# Altium project Hydra A1 UCLO 35131D.PrjPCB (part 12 of 14)
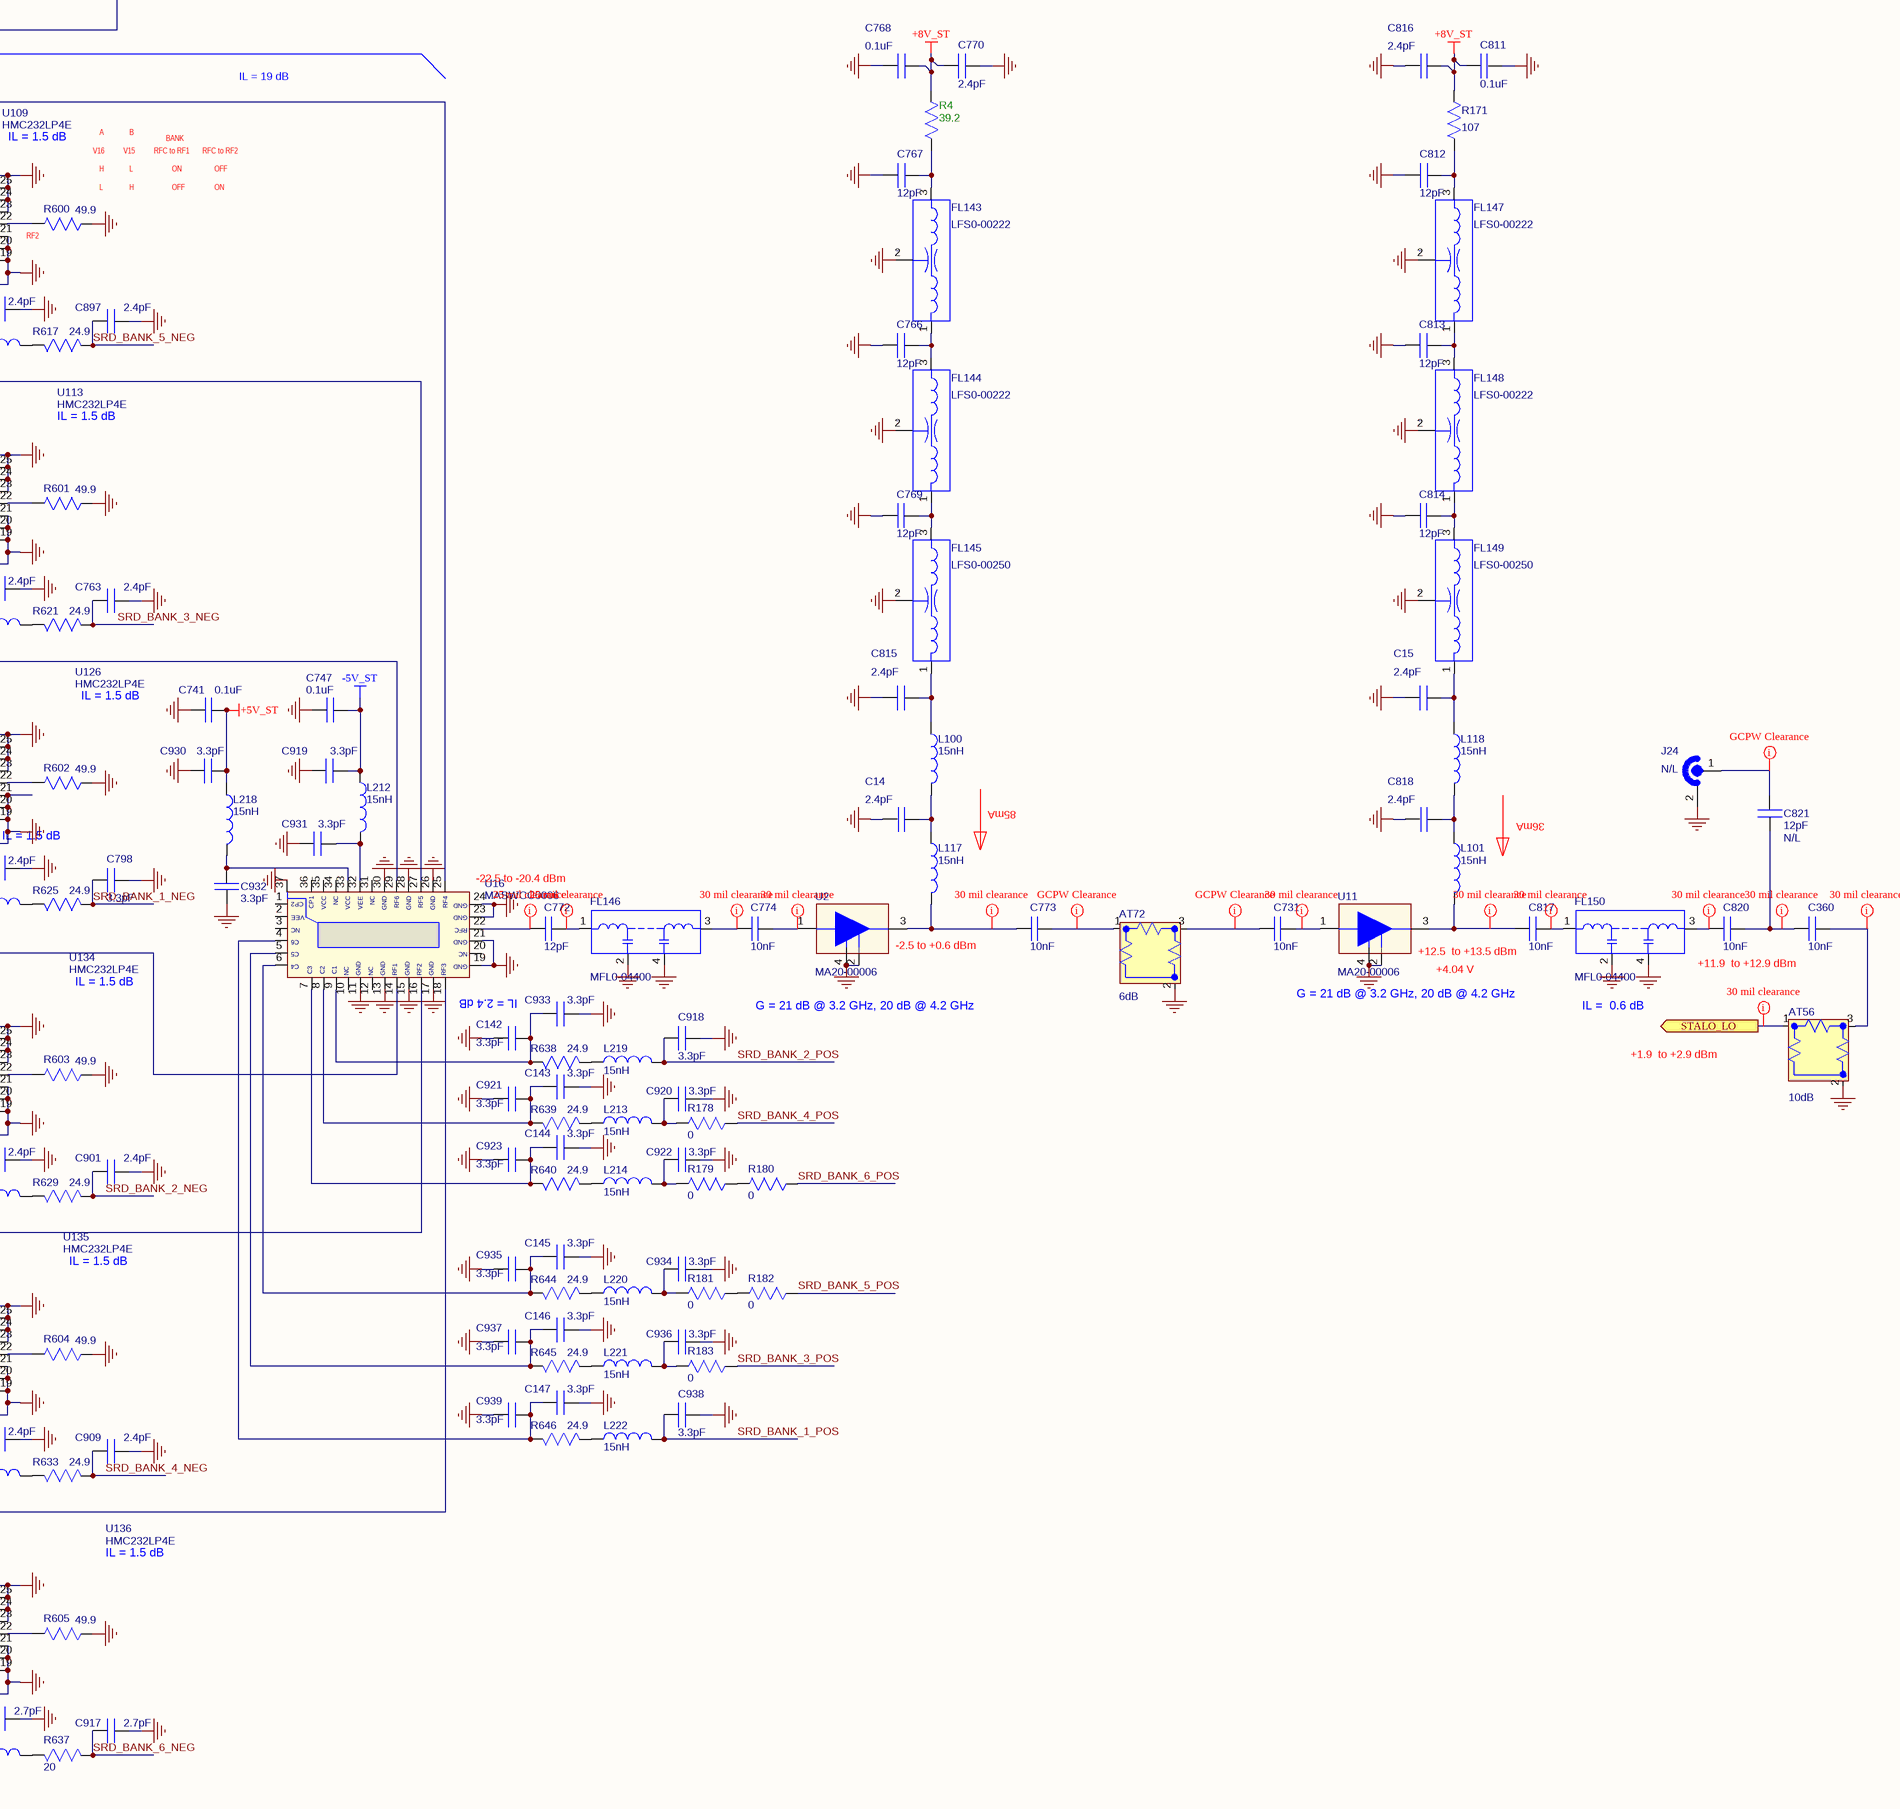
[diagram p76: STALO_1.SchDoc, bottom right]

## Sheet STALO_1.SchDoc: STALO_1 (continued)

### Nets
+5V_ST: C388.1 C741.1 C742.1 C930.2 FT17.1 L138.1 L218.2
+8V_ST: C2.1 C3.1 C768.1 C770.2 C771.2 C811.1 C816.1 FT32.1 R4.1 R171.1 R599.2
-5V_ST: C436.1 C743.1 C747.1 C919.2 FT6.1 L167.1 L212.2
GND: AT1.2(GND) AT3.2(GND) AT6.2(GND) AT10.2(GND) AT12.2(GND) AT14.2(GND) AT43.2(GND) AT44.2(GND) AT45.2(GND) AT46.2(GND) AT47.2(GND) AT48.2(GND) AT49.2(GND) AT50.2(GND) AT51.2(GND) AT52.2(GND) AT56.2(GND) AT72.2(GND) C1.2 C2.2 C3.2 C4.1 C9.1 C11.1 C13.2 C14.2 C15.1 C142.1 C143.2 C144.2 C145.2 C146.2 C147.2 C187.1 C387.2 C388.2 C389.2 C390.2 C391.2 C392.2 C436.2 C437.2 C438.2 C439.2 C717.1 C741.2 C742.2 C743.2 C747.2 C754.2 C755.2 C756.2 C757.2 C758.2 C759.2 C760.2 C761.2 C762.2 C763.2 C764.2 C765.2 C766.1 C767.2 C768.2 C769.1 C770.1 C771.1 C778.2 C779.2 C785.2 C786.2 C791.2 C792.2 C797.2 C798.2 C803.2 C804.2 C809.2 C810.2 C811.2 C812.2 C813.1 C814.1 C815.1 C816.2 C818.2 C894.2 C895.2 C896.2 C897.2 C898.2 C899.2 C900.2 C901.2 C902.2 C903.2 C904.2 C905.2 C906.2 C907.2 C908.2 C909.2 C910.2 C911.2 C912.2 C913.2 C914.2 C915.2 C916.2 C917.2 C918.2 C919.1 C920.2 C921.1 C922.2 C923.1 C924.2 C925.1 C926.2 C927.1 C928.2 C929.1 C930.1 C931.1 C932.1 C933.2 C934.2 C935.1 C936.2 C937.1 C938.2 C939.1 C940.2 C941.2 C942.2 C943.1 C944.1 C945.1 FL1.2(GND) FL2.2(GND) FL3.2(GND) FL4.2(GND) FL4.4(GND) FL4.5(GND) FL4.6(GND) FL7.3 FL7.4 FL7.5 FL7.6 FL7.7 FL7.8 FL7.9 FL7.10 FL7.11 FL7.12 FL8.3 FL8.4 FL8.5 FL8.6 FL8.7 FL8.8 FL8.9 FL8.10 FL8.11 FL8.12 FL16.3 FL16.4 FL16.5 FL16.6 FL16.7 FL16.8 FL16.9 FL16.10 FL16.11 FL16.12 FL17.3 FL17.4 FL17.5 FL17.6 FL17.7 FL17.8 FL17.9 FL17.10 FL17.11 FL17.12 FL24.3 FL24.4 FL24.5 FL24.6 FL24.7 FL24.8 FL24.9 FL24.10 FL24.11 FL24.12 FL25.3 FL25.4 FL25.5 FL25.6 FL25.7 FL25.8 FL25.9 FL25.10 FL25.11 FL25.12 FL30.3 FL30.4 FL30.5 FL30.6 FL30.7 FL30.8 FL30.9 FL30.10 FL30.11 FL30.12 FL31.3 FL31.4 FL31.5 FL31.6 FL31.7 FL31.8 FL31.9 FL31.10 FL31.11 FL31.12 FL35.3 FL35.4 FL35.5 FL35.6 FL35.7 FL35.8 FL35.9 FL35.10 FL35.11 FL35.12 FL36.3 FL36.4 FL36.5 FL36.6 FL36.7 FL36.8 FL36.9 FL36.10 FL36.11 FL36.12 FL40.3 FL40.4 FL40.5 FL40.6 FL40.7 FL40.8 FL40.9 FL40.10 FL40.11 FL40.12 FL41.3 FL41.4 FL41.5 FL41.6 FL41.7 FL41.8 FL41.9 FL41.10 FL41.11 FL41.12 FL93.2(GND) FL93.4(GND) FL143.2(GND) FL144.2(GND) FL145.2(GND) FL146.2(OUT) FL146.4(GND) FL147.2(GND) FL148.2(GND) FL149.2(GND) FL150.2(OUT) FL150.4(GND) J23.2(GND) J24.2(GND) L6.1 L7.1 L46.1 L52.1 L53.1 L58.1 L60.1 L61.1 L62.1 L63.1 L64.1 L70.1 L72.1 L74.1 L75.1 L80.1 L81.1 L82.1 L83.1 L86.1 L87.1 L92.1 L93.1 L94.1 L95.1 L97.1 R1.2 R3.2 R401.2 R596.2 R597.2 R598.2 R600.2 R601.2 R602.2 R603.2 R604.2 R605.2 U1.1(GND) U1.4(GND) U1.5(GND) U2.2(GND) U2.4 U5.1(Vdd) U5.2(Vctl) U5.3(G) U5.5(G) U5.6(NC) U5.7(NC) U5.8(G) U5.10(G) U5.11(NC) U5.12(RF2) U5.13(NC) U5.14(NC) U5.17(NC) U5.18(NC) U5.19(NC) U5.20(NC) U5.21(G) U5.23(G) U5.24(NC) U5.25(G) U6.1(Vdd) U6.2(Vctl) U6.3(G) U6.5(G) U6.6(NC) U6.7(NC) U6.8(G) U6.10(G) U6.11(NC) U6.12(RF2) U6.13(NC) U6.14(NC) U6.17(NC) U6.18(NC) U6.19(NC) U6.20(NC) U6.21(G) U6.23(G) U6.24(NC) U6.25(G) U11.2(GND) U11.4 U12.1(Vdd) U12.2(Vctl) U12.3(G) U12.5(G) U12.6(NC) U12.7(NC) U12.8(G) U12.10(G) U12.11(NC) U12.12(RF2) U12.13(NC) U12.14(NC) U12.17(NC) U12.18(NC) U12.19(NC) U12.20(NC) U12.21(G) U12.23(G) U12.24(NC) U12.25(G) U14.11(GND) U14.13(GND) U14.15(GND) U14.17(GND) U14.19(GND) U14.21(GND) U14.23(GND) U14.24(GND) U14.26(GND) U14.28(GND) U14.30(GND) U14.37(GND) U16.11(GND) U16.13(GND) U16.15(GND) U16.17(GND) U16.19(GND) U16.21(GND) U16.23(GND) U16.24(GND) U16.26(GND) U16.28(GND) U16.30(GND) U16.37(GND) U19.1(Vdd) U19.2(Vctl) U19.3(G) U19.5(G) U19.6(NC) U19.7(NC) U19.8(G) U19.10(G) U19.11(NC) U19.12(RF2) U19.13(NC) U19.14(NC) U19.17(NC) U19.18(NC) U19.19(NC) U19.20(NC) U19.21(G) U19.23(G) U19.24(NC) U19.25(G) U21.1(Vdd) U21.2(Vctl) U21.3(G) U21.5(G) U21.6(NC) U21.7(NC) U21.8(G) U21.10(G) U21.11(NC) U21.12(RF2) U21.13(NC) U21.14(NC) U21.17(NC) U21.18(NC) U21.19(NC) U21.20(NC) U21.21(G) U21.23(G) U21.24(NC) U21.25(G) U24.1(Vdd) U24.2(Vctl) U24.3(G) U24.5(G) U24.6(NC) U24.7(NC) U24.8(G) U24.10(G) U24.11(NC) U24.12(RF2) U24.13(NC) U24.14(NC) U24.17(NC) U24.18(NC) U24.19(NC) U24.20(NC) U24.21(G) U24.23(G) U24.24(NC) U24.25(G) U109.1(Vdd) U109.2(Vctl) U109.3(G) U109.5(G) U109.6(NC) U109.7(NC) U109.8(G) U109.10(G) U109.11(NC) U109.12(RF2) U109.13(NC) U109.14(NC) U109.17(NC) U109.18(NC) U109.19(NC) U109.20(NC) U109.21(G) U109.23(G) U109.24(NC) U109.25(G) U113.1(Vdd) U113.2(Vctl) U113.3(G) U113.5(G) U113.6(NC) U113.7(NC) U113.8(G) U113.10(G) U113.11(NC) U113.12(RF2) U113.13(NC) U113.14(NC) U113.17(NC) U113.18(NC) U113.19(NC) U113.20(NC) U113.21(G) U113.23(G) U113.24(NC) U113.25(G) U126.1(Vdd) U126.2(Vctl) U126.3(G) U126.5(G) U126.6(NC) U126.7(NC) U126.8(G) U126.10(G) U126.11(NC) U126.12(RF2) U126.13(NC) U126.14(NC) U126.17(NC) U126.18(NC) U126.19(NC) U126.20(NC) U126.21(G) U126.23(G) U126.24(NC) U126.25(G) U133.2(GND) U133.4 U134.1(Vdd) U134.2(Vctl) U134.3(G) U134.5(G) U134.6(NC) U134.7(NC) U134.8(G) U134.10(G) U134.11(NC) U134.12(RF2) U134.13(NC) U134.14(NC) U134.17(NC) U134.18(NC) U134.19(NC) U134.20(NC) U134.21(G) U134.23(G) U134.24(NC) U134.25(G) U135.1(Vdd) U135.2(Vctl) U135.3(G) U135.5(G) U135.6(NC) U135.7(NC) U135.8(G) U135.10(G) U135.11(NC) U135.12(RF2) U135.13(NC) U135.14(NC) U135.17(NC) U135.18(NC) U135.19(NC) U135.20(NC) U135.21(G) U135.23(G) U135.24(NC) U135.25(G) U136.1(Vdd) U136.2(Vctl) U136.3(G) U136.5(G) U136.6(NC) U136.7(NC) U136.8(G) U136.10(G) U136.11(NC) U136.12(RF2) U136.13(NC) U136.14(NC) U136.17(NC) U136.18(NC) U136.19(NC) U136.20(NC) U136.21(G) U136.23(G) U136.24(NC) U136.25(G)
~{SRD_BANK_1_NEG}: C764.1 C797.1 R622.1 R624.1 ; port ~{SRD_BANK_1_NEG}
~{SRD_BANK_2_NEG}: C898.1 C900.1 R626.1 R628.1 ; port ~{SRD_BANK_2_NEG}
~{SRD_BANK_3_NEG}: C760.1 C762.1 R618.1 R620.1 ; port ~{SRD_BANK_3_NEG}
~{SRD_BANK_4_NEG}: C906.1 C908.1 R630.1 R632.1 ; port ~{SRD_BANK_4_NEG}
~{SRD_BANK_5_NEG}: C754.1 C896.1 R319.1 R616.1 ; port ~{SRD_BANK_5_NEG}
~{SRD_BANK_6_NEG}: C914.1 C916.1 R634.1 R636.1 ; port ~{SRD_BANK_6_NEG}
SRD_BANK_1_NEG: C792.1 C798.1 R623.1 R625.1 ; port SRD_BANK_1_NEG
SRD_BANK_1_POS: C938.1 C940.1 L222.1 L223.1 ; port SRD_BANK_1_POS
SRD_BANK_2_NEG: C899.1 C901.1 R627.1 R629.1 ; port SRD_BANK_2_NEG
SRD_BANK_2_POS: C918.1 C928.1 L217.1 L219.1 ; port SRD_BANK_2_POS
SRD_BANK_3_NEG: C761.1 C763.1 R619.1 R621.1 ; port SRD_BANK_3_NEG
SRD_BANK_3_POS: C941.1 L224.1 R183.2 ; port SRD_BANK_3_POS
SRD_BANK_4_NEG: C907.1 C909.1 R631.1 R633.1 ; port SRD_BANK_4_NEG
SRD_BANK_4_POS: C926.1 L216.1 R178.2 ; port SRD_BANK_4_POS
SRD_BANK_5_NEG: C895.1 C897.1 R322.1 R617.1 ; port SRD_BANK_5_NEG
SRD_BANK_5_POS: C942.1 L225.1 R182.2 ; port SRD_BANK_5_POS
SRD_BANK_6_NEG: C915.1 C917.1 R635.1 R637.1 ; port SRD_BANK_6_NEG
SRD_BANK_6_POS: C924.1 L215.1 R180.2 ; port SRD_BANK_6_POS
STALO_LO: AT56.1(IN/OUT) ; port STALO_LO
NetAT1_1: AT1.1(IN/OUT) FL7.1 L58.2
NetAT1_3: AT1.3(IN/OUT) FL8.2 L53.2
NetAT3_1: AT3.1(IN/OUT) FL16.1 L61.2
NetAT3_3: AT3.3(IN/OUT) FL17.2 L63.2
NetAT6_1: AT6.1(IN/OUT) FL24.1 L70.2
NetAT6_3: AT6.3(IN/OUT) FL25.2 L74.2
NetAT10_1: AT10.1(IN/OUT) FL30.1 L80.2
NetAT10_3: AT10.3(IN/OUT) FL31.2 L82.2
NetAT12_1: AT12.1(IN/OUT) FL35.1 L86.2
NetAT12_3: AT12.3(IN/OUT) FL36.2 L92.2
NetAT14_1: AT14.1(IN/OUT) FL41.1 L94.2
NetAT14_3: AT14.3(IN/OUT) FL40.2 L97.2
NetAT43_1: AT43.1(IN/OUT) FL4.3(OUT)
NetAT43_3: AT43.3(IN/OUT) U1.3(R)
NetAT44_1: AT44.1(IN/OUT) U1.2(I)
NetAT44_3: AT44.3(IN/OUT) L3.2
NetAT45_1: AT45.1(IN/OUT) FL4.1(IN)
NetAT45_3: AT45.3(IN/OUT) FL93.1(IN)
NetAT46_1: AT46.1(IN/OUT) FL93.3(OUT)
NetAT46_3: AT46.3(IN/OUT) C10.1
NetAT47_1: AT47.1(IN/OUT) FL8.1 L52.2
NetAT47_3: AT47.3(IN/OUT) C777.1
NetAT48_1: AT48.1(IN/OUT) FL17.1 L62.2
NetAT48_3: AT48.3(IN/OUT) C784.1
NetAT49_1: AT49.1(IN/OUT) FL25.1 L72.2
NetAT49_3: AT49.3(IN/OUT) C790.1
NetAT50_1: AT50.1(IN/OUT) FL31.1 L81.2
NetAT50_3: AT50.3(IN/OUT) C796.1
NetAT51_1: AT51.1(IN/OUT) FL36.1 L87.2
NetAT51_3: AT51.3(IN/OUT) C802.1
NetAT52_1: AT52.1(IN/OUT) FL40.1 L95.2
NetAT52_3: AT52.3(IN/OUT) C808.1
NetAT56_3: AT56.3(IN/OUT) C360.2
NetAT58_3: L2.1 ; port 200_MHz_Comb
NetAT72_1: AT72.1(IN/OUT) C773.2
NetAT72_3: AT72.3(IN/OUT) C731.1
NetC1_1: C1.1 FL3.1(IN) L205.1
NetC4_2: C4.2 FL1.1(IN) FL2.3(OUT)
NetC5_1: C5.1 C789.2 L99.2 U133.3
NetC5_2: C5.2 U14.22(RFC)
NetC6_1: C6.1 C8.2 C9.2 L7.2
NetC6_2: C6.2 L4.2
NetC7_1: C7.1 C11.2 L4.1 L6.2
NetC7_2: C7.2 L2.2
NetC8_1: C8.1 L3.1
NetC10_2: C10.2 U133.1
NetC13_1: C13.1 L99.1 L205.2
NetC14_1: C14.1 L100.2 L117.1
NetC15_2: C15.2 FL149.1(IN) L118.1
NetC142_2: C142.2 C933.1 R638.2 U16.9(C1)
NetC143_1: C143.1 C921.2 R639.2 U16.8(C2)
NetC144_1: C144.1 C923.2 R640.2 U16.7(C3)
NetC145_1: C145.1 C935.2 R644.2 U16.6(C4)
NetC146_1: C146.1 C937.2 R645.2 U16.5(C5)
NetC147_1: C147.1 C939.2 R646.2 U16.4(C6)
NetC187_2: C187.2 FL1.3(OUT) R599.1
NetC360_1: C360.1 C820.2 C821.1
NetC387_1: C387.1 L138.2 U14.33(VCC)
NetC389_1: C389.1 L167.2 U14.32(VEE)
NetC390_1: C390.1 C925.2 R641.2 U14.6(C4)
NetC391_1: C391.1 C944.2 R648.2 U14.8(C2)
NetC392_1: C392.1 C945.2 R649.2 U14.7(C3)
NetC437_1: C437.1 C927.2 R642.2 U14.5(C5)
NetC438_1: C438.1 C929.2 R643.2 U14.4(C6)
NetC439_1: C439.1 C943.2 R647.2 U14.9(C1)
NetC717_2: C717.2 FL2.1(IN) FL3.3(OUT)
NetC731_2: C731.2 U11.1
NetC732_1: C732.1 U14.18(RF3)
NetC732_2: C732.2 U5.9(RF1)
NetC733_1: C733.1 U5.4(NC)
NetC733_2: C733.2 FL7.2 L46.2
NetC736_1: C736.1 U6.4(NC)
NetC736_2: C736.2 FL16.2 L60.2
NetC738_1: C738.1 U14.14(RF1)
NetC738_2: C738.2 U12.9(RF1)
NetC739_1: C739.1 U12.4(NC)
NetC739_2: C739.2 FL24.2 L64.2
NetC744_1: C744.1 U14.29(RF6)
NetC744_2: C744.2 U19.9(RF1)
NetC745_1: C745.1 U19.4(NC)
NetC745_2: C745.2 FL30.2 L75.2
NetC748_1: C748.1 U14.27(RF5)
NetC748_2: C748.2 U21.9(RF1)
NetC749_1: C749.1 U21.4(NC)
NetC749_2: C749.2 FL35.2 L83.2
NetC751_1: C751.1 U14.25(RF4)
NetC751_2: C751.2 U24.9(RF1)
NetC752_1: C752.1 U24.4(NC)
NetC752_2: C752.2 FL41.2 L93.2
NetC755_1: C755.1 L96.2 U5.16(A)
NetC756_1: C756.1 L103.2 U6.15(B)
NetC757_1: C757.1 L104.2 U6.16(A)
NetC758_1: C758.1 L105.2 U113.15(B)
NetC759_1: C759.1 L106.2 U113.16(A)
NetC765_1: C765.1 L107.2 U12.15(B)
NetC766_2: C766.2 FL143.1(IN) FL144.3(OUT)
NetC767_1: C767.1 FL143.3(OUT) R4.2
NetC769_2: C769.2 FL144.1(IN) FL145.3(OUT)
NetC772_1: C772.1 U16.22(RFC)
NetC772_2: C772.2 FL146.1(IN)
NetC773_1: C773.1 L117.2 U2.3
NetC774_1: C774.1 FL146.3(GND)
NetC774_2: C774.2 U2.1
NetC775_1: C775.1 U109.4(NC)
NetC775_2: C775.2 U16.25(RF4)
NetC777_2: C777.2 U109.9(RF1)
NetC778_1: C778.1 L98.2 U109.15(B)
NetC779_1: C779.1 L102.2 U109.16(A)
NetC781_1: C781.1 U113.4(NC)
NetC781_2: C781.2 U16.27(RF5)
NetC783_1: C783.1 U14.16(RF2)
NetC783_2: C783.2 U6.9(RF1)
NetC784_2: C784.2 U113.9(RF1)
NetC785_1: C785.1 L108.2 U12.16(A)
NetC786_1: C786.1 L109.2 U126.15(B)
NetC788_1: C788.1 U126.4(NC)
NetC788_2: C788.2 U16.29(RF6)
NetC789_1: C789.1 J23.1(CNTR)
NetC790_2: C790.2 U126.9(RF1)
NetC791_1: C791.1 L110.2 U126.16(A)
NetC794_1: C794.1 U134.4(NC)
NetC794_2: C794.2 U16.14(RF1)
NetC796_2: C796.2 U134.9(RF1)
NetC800_1: C800.1 U135.4(NC)
NetC800_2: C800.2 U16.16(RF2)
NetC802_2: C802.2 U135.9(RF1)
NetC803_1: C803.1 L111.2 U19.15(B)
NetC804_1: C804.1 L112.2 U19.16(A)
NetC806_1: C806.1 U136.4(NC)
NetC806_2: C806.2 U16.18(RF3)
NetC808_2: C808.2 U136.9(RF1)
NetC809_1: C809.1 L113.2 U134.15(B)
NetC810_1: C810.1 L114.2 U134.16(A)
NetC812_1: C812.1 FL147.3(OUT) R171.2
NetC813_2: C813.2 FL147.1(IN) FL148.3(OUT)
NetC814_2: C814.2 FL148.1(IN) FL149.3(OUT)
NetC815_2: C815.2 FL145.1(IN) L100.1
NetC817_1: C817.1 L101.2 U11.3
NetC817_2: C817.2 FL150.1(IN)
NetC818_1: C818.1 L101.1 L118.2
NetC820_1: C820.1 FL150.3(GND)
NetC821_2: C821.2 J24.1(CNTR)
NetC894_1: C894.1 L91.2 U5.15(B)
NetC902_1: C902.1 L115.2 U21.15(B)
NetC903_1: C903.1 L116.2 U21.16(A)
NetC904_1: C904.1 L204.2 U135.15(B)
NetC905_1: C905.1 L207.2 U135.16(A)
NetC910_1: C910.1 L208.2 U24.15(B)
NetC911_1: C911.1 L209.2 U24.16(A)
NetC912_1: C912.1 L210.2 U136.15(B)
NetC913_1: C913.1 L211.2 U136.16(A)
NetC920_1: C920.1 L213.1 R178.1
NetC922_1: C922.1 L214.1 R179.1
NetC931_2: C931.2 L212.1 U16.32(VEE)
NetC932_2: C932.2 L218.1 U16.33(VCC)
NetC934_1: C934.1 L220.1 R181.1
NetC936_1: C936.1 L221.1 R183.1
NetL91_1: L91.1 R319.2
NetL96_1: L96.1 R322.2
NetL98_1: L98.1 R616.2
NetL102_1: L102.1 R617.2
NetL103_1: L103.1 R618.2
NetL104_1: L104.1 R619.2
NetL105_1: L105.1 R620.2
NetL106_1: L106.1 R621.2
NetL107_1: L107.1 R622.2
NetL108_1: L108.1 R623.2
NetL109_1: L109.1 R624.2
NetL110_1: L110.1 R625.2
NetL111_1: L111.1 R626.2
NetL112_1: L112.1 R627.2
NetL113_1: L113.1 R628.2
NetL114_1: L114.1 R629.2
NetL115_1: L115.1 R630.2
NetL116_1: L116.1 R631.2
NetL204_1: L204.1 R632.2
NetL207_1: L207.1 R633.2
NetL208_1: L208.1 R634.2
NetL209_1: L209.1 R635.2
NetL210_1: L210.1 R636.2
NetL211_1: L211.1 R637.2
NetL213_2: L213.2 R639.1
NetL214_2: L214.2 R640.1
NetL215_2: L215.2 R641.1
NetL216_2: L216.2 R642.1
NetL217_2: L217.2 R643.1
NetL219_2: L219.2 R638.1
NetL220_2: L220.2 R644.1
NetL221_2: L221.2 R645.1
NetL222_2: L222.2 R646.1
NetL223_2: L223.2 R647.1
NetL224_2: L224.2 R648.1
NetL225_2: L225.2 R649.1
NetR1_1: R1.1 U5.22(RF2)
NetR3_1: R3.1 U6.22(RF2)
NetR179_2: R179.2 R180.1
NetR181_2: R181.2 R182.1
NetR401_1: R401.1 U12.22(RF2)
NetR596_1: R596.1 U19.22(RF2)
NetR597_1: R597.1 U21.22(RF2)
NetR598_1: R598.1 U24.22(RF2)
NetR600_1: R600.1 U109.22(RF2)
NetR601_1: R601.1 U113.22(RF2)
NetR602_1: R602.1 U126.22(RF2)
NetR603_1: R603.1 U134.22(RF2)
NetR604_1: R604.1 U135.22(RF2)
NetR605_1: R605.1 U136.22(RF2)
NetU1_6: U1.6(L) ; port 2400MHz_Stalo

Not connected (* = marked no-connect by the designer): U14 1(CP2) 2(VEE) 3(NC) 10(NC) 12(NC) 20(NC) 31(NC) 34(NC) 35(VCC) 36(CP1); U16 1(CP2) 2(VEE) 3(NC) 10(NC) 12(NC) 20(NC) 31(NC) 34(NC) 35(VCC) 36(CP1)

### Layout directives
net class GCPW Clearance: NetAT72_1, NetAT72_3, NetC789_1, NetC821_2, NetU1_6
net class 30 mil clearance: NetAT1_1, NetAT1_3, NetAT3_1, NetAT3_3, NetAT6_1, NetAT6_3, NetAT10_1, NetAT10_3, NetAT12_1, NetAT12_3, NetAT14_1, NetAT14_3, NetAT43_1, NetAT43_3, NetAT44_1, NetAT44_3, NetAT45_1, NetAT45_3, NetAT46_1, NetAT46_3, NetAT47_1, NetAT47_3, NetAT48_1, NetAT48_3, NetAT49_1, NetAT49_3, NetAT50_1, NetAT50_3, NetAT51_1, NetAT51_3, NetAT52_1, NetAT52_3, NetAT56_3, NetC6_1, NetC6_2, NetC7_1, NetC7_2, NetC8_1, NetC10_2, NetC360_1, NetC731_2, NetC736_2, NetC739_2, NetC745_2, NetC749_2, NetC752_2, NetC773_1, NetC774_1, NetC774_2, NetC817_1, NetC817_2, NetC820_1, STALO_LO
net class 25 mil clearance: NetC5_1, NetC5_2, NetC732_1, NetC738_1, NetC744_1, NetC748_1, NetC751_1, NetC772_1, NetC772_2, NetC775_2, NetC781_2, NetC783_1, NetC788_2, NetC794_2, NetC800_2, NetC806_2
net class 9.7 mil gap: NetC732_2, NetC733_1, NetC736_1, NetC738_2, NetC739_1, NetC744_2, NetC745_1, NetC748_2, NetC749_1, NetC751_2, NetC752_1, NetC775_1, NetC777_2, NetC781_1, NetC783_2, NetC784_2, NetC788_1, NetC790_2, NetC794_1, NetC796_2, NetC800_1, NetC802_2, NetC806_1, NetC808_2

### Notes on the sheet
- AND DESIGN RIGHTS BELONGING TO GIGA-TRONICS
- THIS DOCUMENT CONTAINS PROPRIETARY INFORMATION
- EXCEPT CALIBRATION, OPERATION, AND MAINTENANCE
- AND MAY NOT BE REPRODUCED FOR ANY REASON
- STALO PAGE 1
- WITHOUT WRITTEN AUTHORIZATION.
- IL= 6.5 - 7 dB
- 85mA
- IL = 6.5 dB
- -23 to -20 dBm
- 2.5 to 5 dBm
- (near U1) CL = 8 dB
- (near C789) G = 21 dB @ 3.2 GHz, 20 dB @ 4.2 GHz
- -3.5 to -1.4 dBm
- 14.2 dBm
- 1.2 GHz  -137dBc
- 3.6 GHz  -124dBc
- IL = 19 dB
- V16
- H
- A
- V15
- L
- B
- RFC to RF1
- BANK
- ON
- RFC to RF2
- (near C732) OFF
- (near U5) RFC
- IL = 3.5 dB
- BANK 5
- RFC
- IL = 1.5 dB
- (near R600) L
- OFF
- (near C732) ON
- RF1
- (near R1) RF2
- (near C777) RF1
- (near R600) RF2
- (near R1) IL = 1.5 dB
- BANK 3
- BANK 1
- (near U126) IL = 1.5 dB
- 36mA
- (near U14) [datasheet] <http://www.macomtech.com/DataSheets/MASWCC0006.pdf>
- (near U16) -22.5 to -20.4 dBm
- (near U2) -2.5 to +0.6 dBm
- (near U11) +12.5  to +13.5 dBm
- (near U11) +4.04 V
- (near FL150) +11.9  to +12.9 dBm
- (near U14) IL = 2.4 dB
- BANK 2
- IL = 2.4 dB
- G = 21 dB @ 3.2 GHz, 20 dB @ 4.2 GHz
- (near FL150) IL =  0.6 dB
- +1.9  to +2.9 dBm
- BANK 4
- BANK 6
- 1.     CAPACITORS VALUES ARE IN pF
- 2.     RESISTOR  VALUES ARE IN OHMS
- NOTES:
- UNLESS OTHERWISE SPECIFIED
- Title
- Sheet Title
- PRINTED DOCUMENT IS CONSIDERED UNCONTROLLED. VERIFY REVISION IN PLM SYSTEM.
- THIS DOCUMENT CONTAINS PROPRIETARY INFORMATION. DESIGN RIGHTS BELONG TO GIGA-TRONICS AND MAY NOT BE REPRODUCED WITHOUT WRITTEN AUTHORIZATION FOR ANY REASON EXCEPT CALIBRATION, OPERATION AND MAINTENANCE.
- Size
- CAGE CODE
- Filename
- D
- Document Number
- 58900
- Date
- Sheet
- Rev
- of
- (in symbol LFS0-00222) ,
- (in symbol LFS0-00250) ,
- (in symbol MRSS-12012) GND

### Library data of the parts
AT1 AT3 AT6 AT10 AT12 AT14 AT46-AT52 = MPFC-A1002: NoLoad: .; Approved: CL; M_PN: IMS1141-02DB; MFGR: IMS RESISTORS; level: 1; line_number: 10; ModifyDate: 3/8/13; G_PN: MPFC-A1002; item_number: MPFC-A1002
AT43 AT44 = MPFC-A1005: NoLoad: .; Approved: CL; M_PN: IMS1141-05DB; MFGR: IMS RESISTORS; level: 1; line_number: 45; ModifyDate: 3/8/13; G_PN: MPFC-A1005; item_number: MPFC-A1005
AT45 = MPFC-A1000: NoLoad: .; Approved: CL; M_PN: IMS1141-00DB; MFGR: IMS RESISTORS; level: 1; line_number: 50; ModifyDate: 4/16/13; G_PN: MPFC-A1000; item_number: MPFC-A1000
AT56 = MPFC-A1010: NoLoad: .; Approved: CL; M_PN: IMS1141-10DB; MFGR: IMS RESISTORS; level: 1; line_number: 55; ModifyDate: 4/23/13; G_PN: MPFC-A1010; item_number: MPFC-A1010
AT72 = MPFC-A1006: NoLoad: .; Approved: CL; M_PN: IMS1141-06DB; MFGR: IMS RESISTORS; level: 1; line_number: 35; ModifyDate: 3/8/13; G_PN: MPFC-A1006; item_number: MPFC-A1006
C1 C13-C15 C187 C754 C755 C758-C764 C770 C771 C778 C779 C786 C791 C792 C803 C804 C809 C810 C815 C816 C818 C894-C901 C904-C909 C914 C915 = CK41-00024: MFGR: ATC; M_PN: 600L2R4AT200; Approved: CL; NoLoad: .; level: 1; line_number: 60; ModifyDate: 02/09/13; G_PN: CK41-00024; item_number: CK41-00024
C2 C768 C811 = CK45-04100: Approved: CL; NoLoad: .; MFGR: ANY; level: 1; line_number: 105; ModifyDate: 02/22/12; G_PN: CK45-04100; M_PN: ANY; item_number: CK45-04100
C3 C4 C717 C766 C767 C769 C812-C814 = CK40-00120: MFGR: ANY; Approved: CL; NoLoad: .; level: 1; line_number: 165; ModifyDate: 10/06/12; M_PN: ANY; G_PN: CK40-00120; item_number: CK40-00120
C5 C10 C732 C733 C736 C738 C739 C744 C745 C748 C749 C751 C752 C772 C775 C777 C781 C783 C784 C788 C790 C794 C796 C800 C802 C806 C808 = CK40-00120: Approved: CL; NoLoad: .; MFGR: ANY; level: 1; line_number: 165; G_PN: CK40-00120; ModifyDate: 10/06/12; M_PN: ANY; item_number: CK40-00120
C6 = CK41-00016: Approved: CL; NoLoad: .; M_PN: 600L1R6AT200; MFGR: ATC; level: 1; line_number: 240; G_PN: CK41-00016; ModifyDate: 4/15/13; item_number: CK41-00016
C7 C8 = CK41-00030: Approved: CL; NoLoad: .; M_PN: 600L3R0AT200; MFGR: ATC; level: 1; line_number: 265; G_PN: CK41-00030; ModifyDate: 02/22/12; item_number: CK41-00030
C9 C11 = CK41-00027: Approved: CL; NoLoad: .; M_PN: 600L2R7AT200; MFGR: ATC; level: 1; line_number: 305; G_PN: CK41-00027; ModifyDate: 4/15/13; item_number: CK41-00027
C142-C147 C387-C392 C436-C439 C756 C757 C765 C785 C797 C798 C902 C903 C910 C911 C918-C945 = CK35-00033: MFGR: VENKEL; M_PN: C0201C0G500-3R3BNP; Approved: CL; NoLoad: .; level: 1; line_number: 155; ModifyDate: 6/24/13; G_PN: CK35-00033; item_number: CK35-00033
C360 C731 C773 C774 C817 C820 = TCC3-03100: Approved: CL; NoLoad: .; MFGR: ATC; M_PN: ATC520L103KT16T; level: 1; line_number: 90; G_PN: TCC3-03100; ModifyDate: 4/26/13; item_number: TCC3-03100
C741-C743 C747 = CK40-04100: Approved: CL; MFGR: VENKEL; M_PN: C0402X7R160-104KNP; NoLoad: .; level: 1; line_number: 95; ModifyDate: 3/29/13; G_PN: CK40-04100; item_number: CK40-04100
C789 C821 = CK40-00120: Approved: CL; MFGR: ANY; level: 1; line_number: 165; G_PN: CK40-00120; ModifyDate: 10/06/12; M_PN: ANY; item_number: CK40-00120
C912 C913 C916 C917 = CK35-00027: MFGR: VENKEL; M_PN: C0201C0G500-2R7BNP; Approved: CL; NoLoad: .; level: 1; line_number: 310; ModifyDate: 6/13/13; G_PN: CK35-00027; item_number: CK35-00027
FL1 FL2 FL143 FL144 FL147 FL148 = LFS0-00222: Approved: CL; NoLoad: .; M_PN: NFE31PT222Z1E9BL; MFGR: MURATA; level: 1; line_number: 335; G_PN: LFS0-00222; ModifyDate: 02/22/12; Value: 2200pF; item_number: LFS0-00222
FL3 FL145 FL149 = LFS0-00250: Approved: NM; NoLoad: .; M_PN: NFL18ST207X1C3; MFGR: MURATA; level: 1; line_number: 415; ModifyDate: 02/22/12; Value: 25pF; G_PN: LFS0-00250; item_number: LFS0-00250
FL4 = MFH0-03100: MFGR: MINI-CIRCUITS; Approved: CL; Value: HFCN-3100D+; NoLoad: .; level: 1; line_number: 445; G_PN: MFH0-03100; ModifyDate: 4/2/13; item_number: MFH0-03100
FL7 FL8 = MFB1-04000: Approved: CL; MFGR: LARK ENGINEERING; NoLoad: .; Value: 4SD4000-U70-6CC; level: 1; line_number: 465; G_PN: MFB1-04000; ModifyDate: 4/8/13; M_PN: 4SD4000-U70-6CC; item_number: MFB1-04000
FL16 FL17 = MFB1-03600: FILTER;CER;BANDPASS;3600MHZ;70MHZ BW;6-SEC;SMT; Approved: CL; MFGR: LARK ENGINEERING; NoLoad: .; level: 1; line_number: 350; ModifyDate: 4/8/13; Value: 4SD3600-U70-6CC; M_PN: 4SD3600-U70-6CC; G_PN: MFB1-03600; item_number: MFB1-03600
FL24 FL25 = MFB1-03200: Approved: CL; MFGR: LARK ENGINEERING; NoLoad: .; Value: 4SD3200-U70-6CC; level: 1; line_number: 375; ModifyDate: 4/8/13; M_PN: 4SD3200-U70-6CC; G_PN: MFB1-03200; item_number: MFB1-03200
FL30 FL31 = MFB1-03400: Approved: CL; MFGR: LARK ENGINEERING; NoLoad: .; Value: 4SD3400-U70-6CC; level: 1; line_number: 420; ModifyDate: 4/8/13; M_PN: 4SD3400-U70-6CC; G_PN: MFB1-03400; item_number: MFB1-03400
FL35 FL36 = MFB1-03800: Approved: CL; MFGR: LARK ENGINEERING; NoLoad: .; Value: 4SD3800-U70-6CC; level: 1; line_number: 435; ModifyDate: 4/8/13; M_PN: 4SD3800-U70-6CC; G_PN: MFB1-03800; item_number: MFB1-03800
FL40 FL41 = MFB1-04200: Approved: CL; MFGR: LARK ENGINEERING; NoLoad: .; Value: 4SD4200-U70-6CC; level: 1; line_number: 450; ModifyDate: 4/8/13; M_PN: 4SD4200-U70-6CC; G_PN: MFB1-04200; item_number: MFB1-04200
FL93 = MFL1-03900: NoLoad: .; Value: LFCN-3800D+; MFGR: MINI-CIRCUITS; Approved: CL; level: 1; line_number: 470; ModifyDate: 3/21/13; G_PN: MFL1-03900; item_number: MFL1-03900
FL146 FL150 = MFL0-04400: NoLoad: .; MFGR: Mini-Circuits; Approved: NM; level: 1; line_number: 340; Value: LFCN-4400; ModifyDate: 11/17/12; M_PN: LFCN-4400; G_PN: MFL0-04400; item_number: MFL0-04400
FT6 FT17 FT32 = FromToNode: level: 1; Approved: *; G_PN: *; MFGR: *; Value: *
J23 J24 = JRSM-40101: Value: 3287-6101; MFGR: SV MICROWAVE; Approved: CL; level: 1; M_PN: 3287-6101; ModifyDate: 4/10/13; G_PN: JRSM-40101; item_number: JRSM-40101
L2 L3 = LSA5-02430: MFGR: COILCRAFT; NoLoad: .; Approved: CL; M_PN: 0603HP-4N3XGLU; level: 1; line_number: 535; ModifyDate: 3/4/13; G_PN: LSA5-02430; item_number: LSA5-02430
L4 = LSA5-02870: MFGR: COILCRAFT; NoLoad: .; Approved: CL; M_PN: 0603HP-8N7XGLU; level: 1; line_number: 575; ModifyDate: 02/22/13; G_PN: LSA5-02870; item_number: LSA5-02870
L6 L7 L75 L80-L82 = LSA5-02390: MFGR: COILCRAFT; NoLoad: .; Approved: CL; M_PN: 0603HP-3N9XGLU; level: 1; line_number: 610; ModifyDate: 3/4/13; G_PN: LSA5-02390; item_number: LSA5-02390
L46 L52 L53 L58 L60-L63 L83 L86 L87 L92 = LSA5-02330: MFGR: COILCRAFT; NoLoad: .; Approved: CL; M_PN: 0603HP-3N3XGLU; level: 1; line_number: 590; ModifyDate: 02/22/12; G_PN: LSA5-02330; item_number: LSA5-02330
L64 L70 L72 L74 = LSA5-02470: MFGR: COILCRAFT; NoLoad: .; Approved: CL; M_PN: 0603HP-4N7XGLU; level: 1; line_number: 615; ModifyDate: 4/5/13; G_PN: LSA5-02470; item_number: LSA5-02470
L91 L96 L98-L118 L138 L167 L204 L205 L207-L225 = LSA6-03150: MFGR: COILCRAFT; NoLoad: .; Approved: CL; M_PN: 0402HP-15NXGLU; level: 1; line_number: 515; ModifyDate: 3/8/13; G_PN: LSA6-03150; item_number: LSA6-03150
L93-L95 L97 = LSA5-02180: MFGR: COILCRAFT; NoLoad: .; Approved: CL; M_PN: 0603HP-1N8XJLU; level: 1; line_number: 625; ModifyDate: 5/16/13; G_PN: LSA5-02180; item_number: LSA5-02180
R1 R3 R401 R596-R598 R600-R605 = RK35-00499: Approved: CL; NoLoad: .; MFGR: ANY; level: 1; line_number: 650; ModifyDate: 02/22/12; G_PN: RK35-00499; M_PN: ANY; item_number: RK35-00499
R4 R599 = RK65-00392: NoLoad: .; MFGR: VISHAY/DALE; Approved: CL; M_PN: CRCW201039R2FKEF; level: 1; line_number: 892; ModifyDate: 10/14/14; G_PN: RK65-00392; item_number: RK65-00392
R171 = RK65-01107: NoLoad: .; MFGR: VISHAY/DALE; Approved: CL; M_PN: CRCW2010107RFKEF; level: 1; line_number: 715; ModifyDate: 4/23/13; G_PN: RK65-01107; item_number: RK65-01107
R178-R183 = RK40-00000: NoLoad: .; MFGR: ANY; Approved: CL; level: 1; line_number: 710; ModifyDate: 3/27/13; M_PN: ANY; G_PN: RK40-00000; item_number: RK40-00000
R319 R322 R616-R635 R638-R649 = RK35-00249: NoLoad: .; Approved: CL; MFGR: ANY; level: 1; line_number: 655; G_PN: RK35-00249; ModifyDate: 02/22/12; M_PN: ANY; item_number: RK35-00249
R636 R637 = RK30-00200: NoLoad: .; Approved: CL; MFGR: Vishay-Dale; M_PN: CRCW020120R0FNED; level: 1; line_number: 782; G_PN: RK30-00200; ModifyDate: 7/24/13; item_number: RK30-00200
U1 = MMTD-00004: M_PN: ADE-42MH+; Approved: NM; MFGR: MINI-CIRCUITS; NoLoad: .; Value: ADE-42MH+; level: 1; line_number: 1095; G_PN: MMTD-00004; ModifyDate: 4/9/13; item_number: MMTD-00004
U2 U11 U133 = MA20-00006: M_PN: SKY65017-70LF; Approved: CL; MFGR: SKYWORKS; NoLoad: .; Value: SKY65017-70LF; level: 1; line_number: 1160; G_PN: MA20-00006; ModifyDate: 6/26/14; item_number: MA20-00006
U5 U6 U12 U19 U21 U24 U109 U113 U126 U134-U136 = MRSS-12012: MFGR: HITTITE; Approved: CL; Value: HMC232LP4E; NoLoad: .; level: 1; line_number: 1210; ModifyDate: 4/8/13; G_PN: MRSS-12012; item_number: MRSS-12012
U14 U16 = MRSS-16004: MFGR: HITTITE; Approved: CL; Value: MASWCC0006; NoLoad: .; level: 1; line_number: 1135; ModifyDate: 4/8/13; G_PN: MRSS-16004; item_number: MRSS-16004

## Sheet STALO_3.SchDoc: STALO_3
size D; Date: 09-24-10; DrawnBy: C. Lewis; Engineer: C. Lewis; Address1: 4650 NORRIS CANYON RD.; Address2: SAN RAMON, CA 94583; DocumentNumber: 35133; Revision: D; SheetNumber: 20; SheetTotal: 20; PageSetup: Record=PageOptions|CenterHorizontal=True|CenterVertical=True|PrintScale=0.34|XCorrection=1.00|YCorrection=1.00|PrintKind=1|BorderSize=5000000|LeftOffset=0|BottomOffset=0|Orientation=2|PaperLength=1000|PaperWidth=1000|Scale=100|PaperSource=15|PrintQuality=600|MediaType=1|DitherType=10|PaperKind=11x17|PrintScaleMode=1; DocumentName: Sheet1.SCHDOC; ModifiedDate: 10-27-11
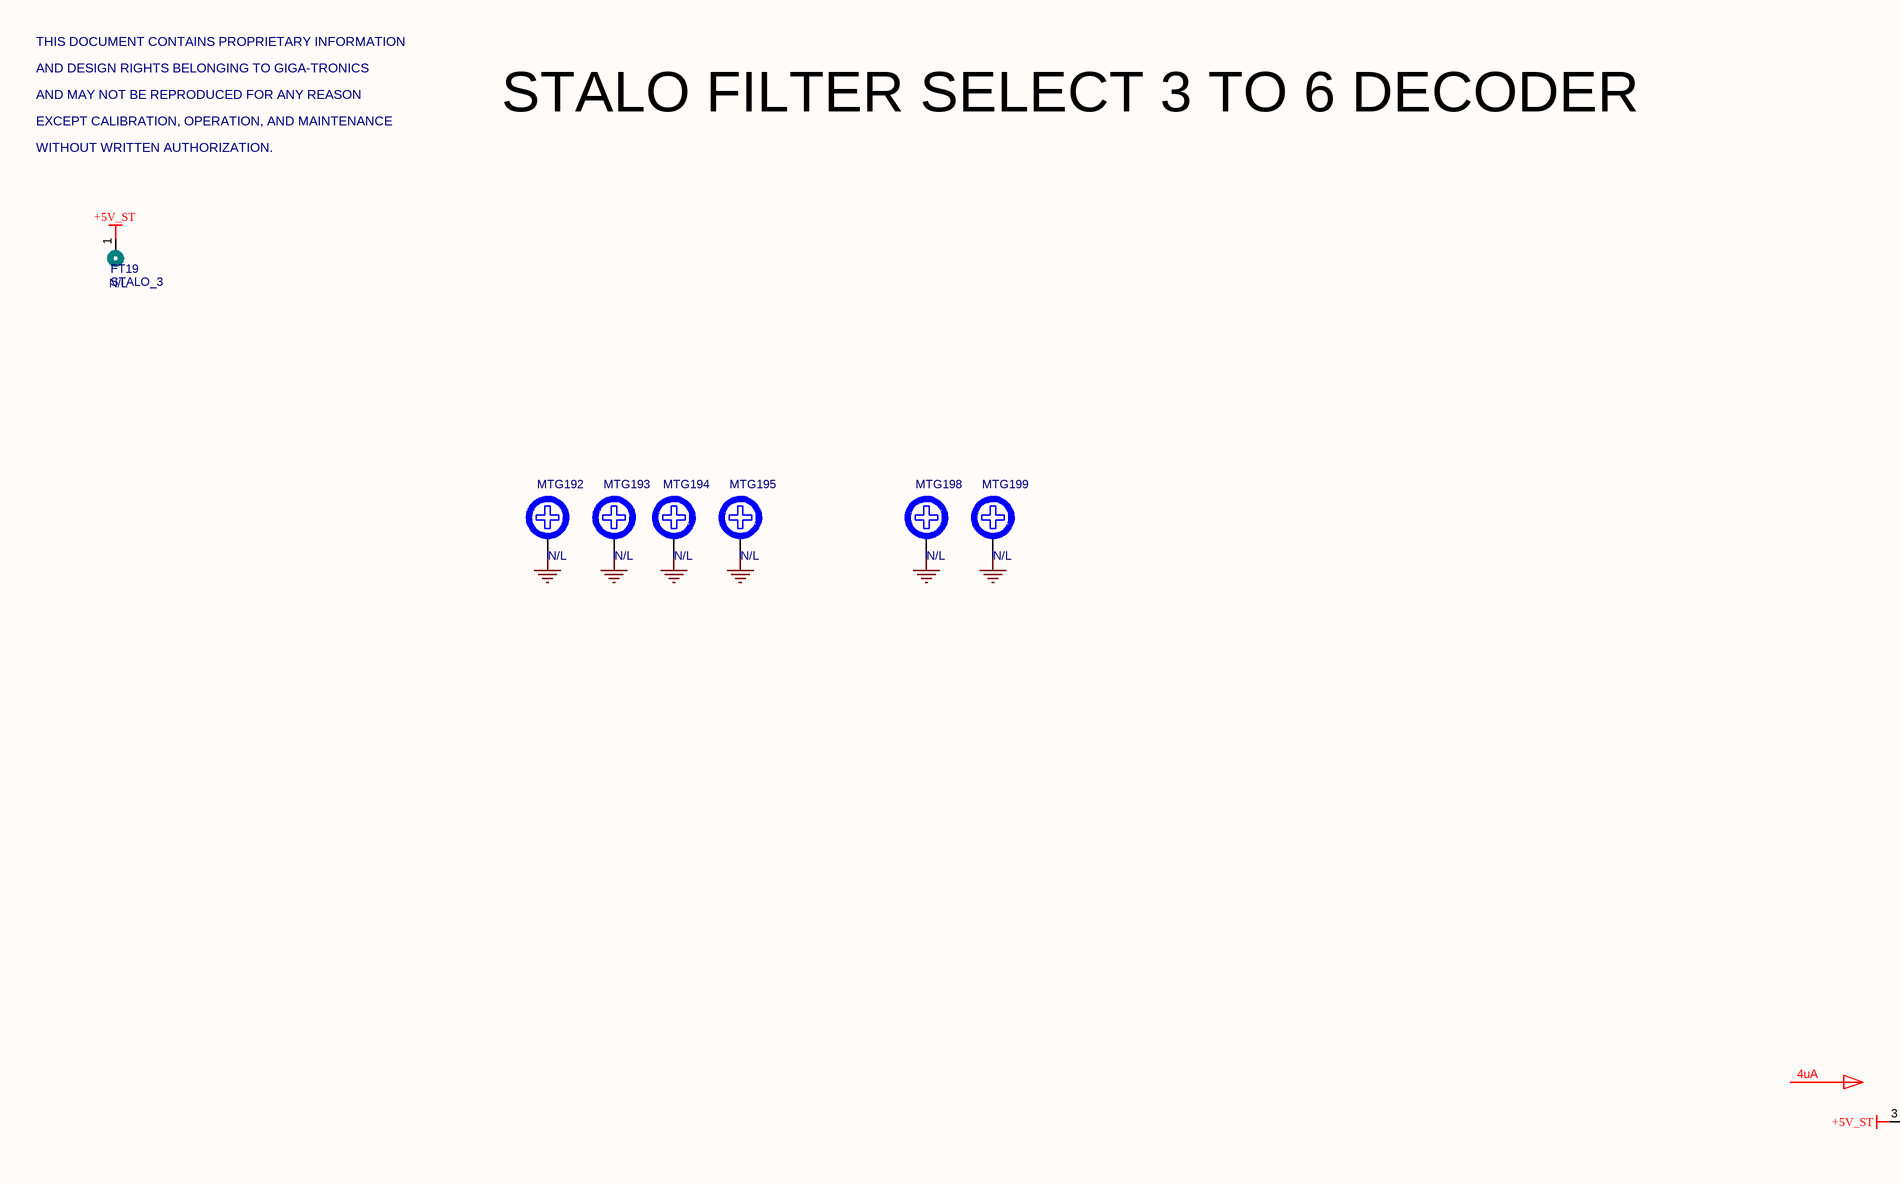
[diagram p61: STALO_3.SchDoc, top left]
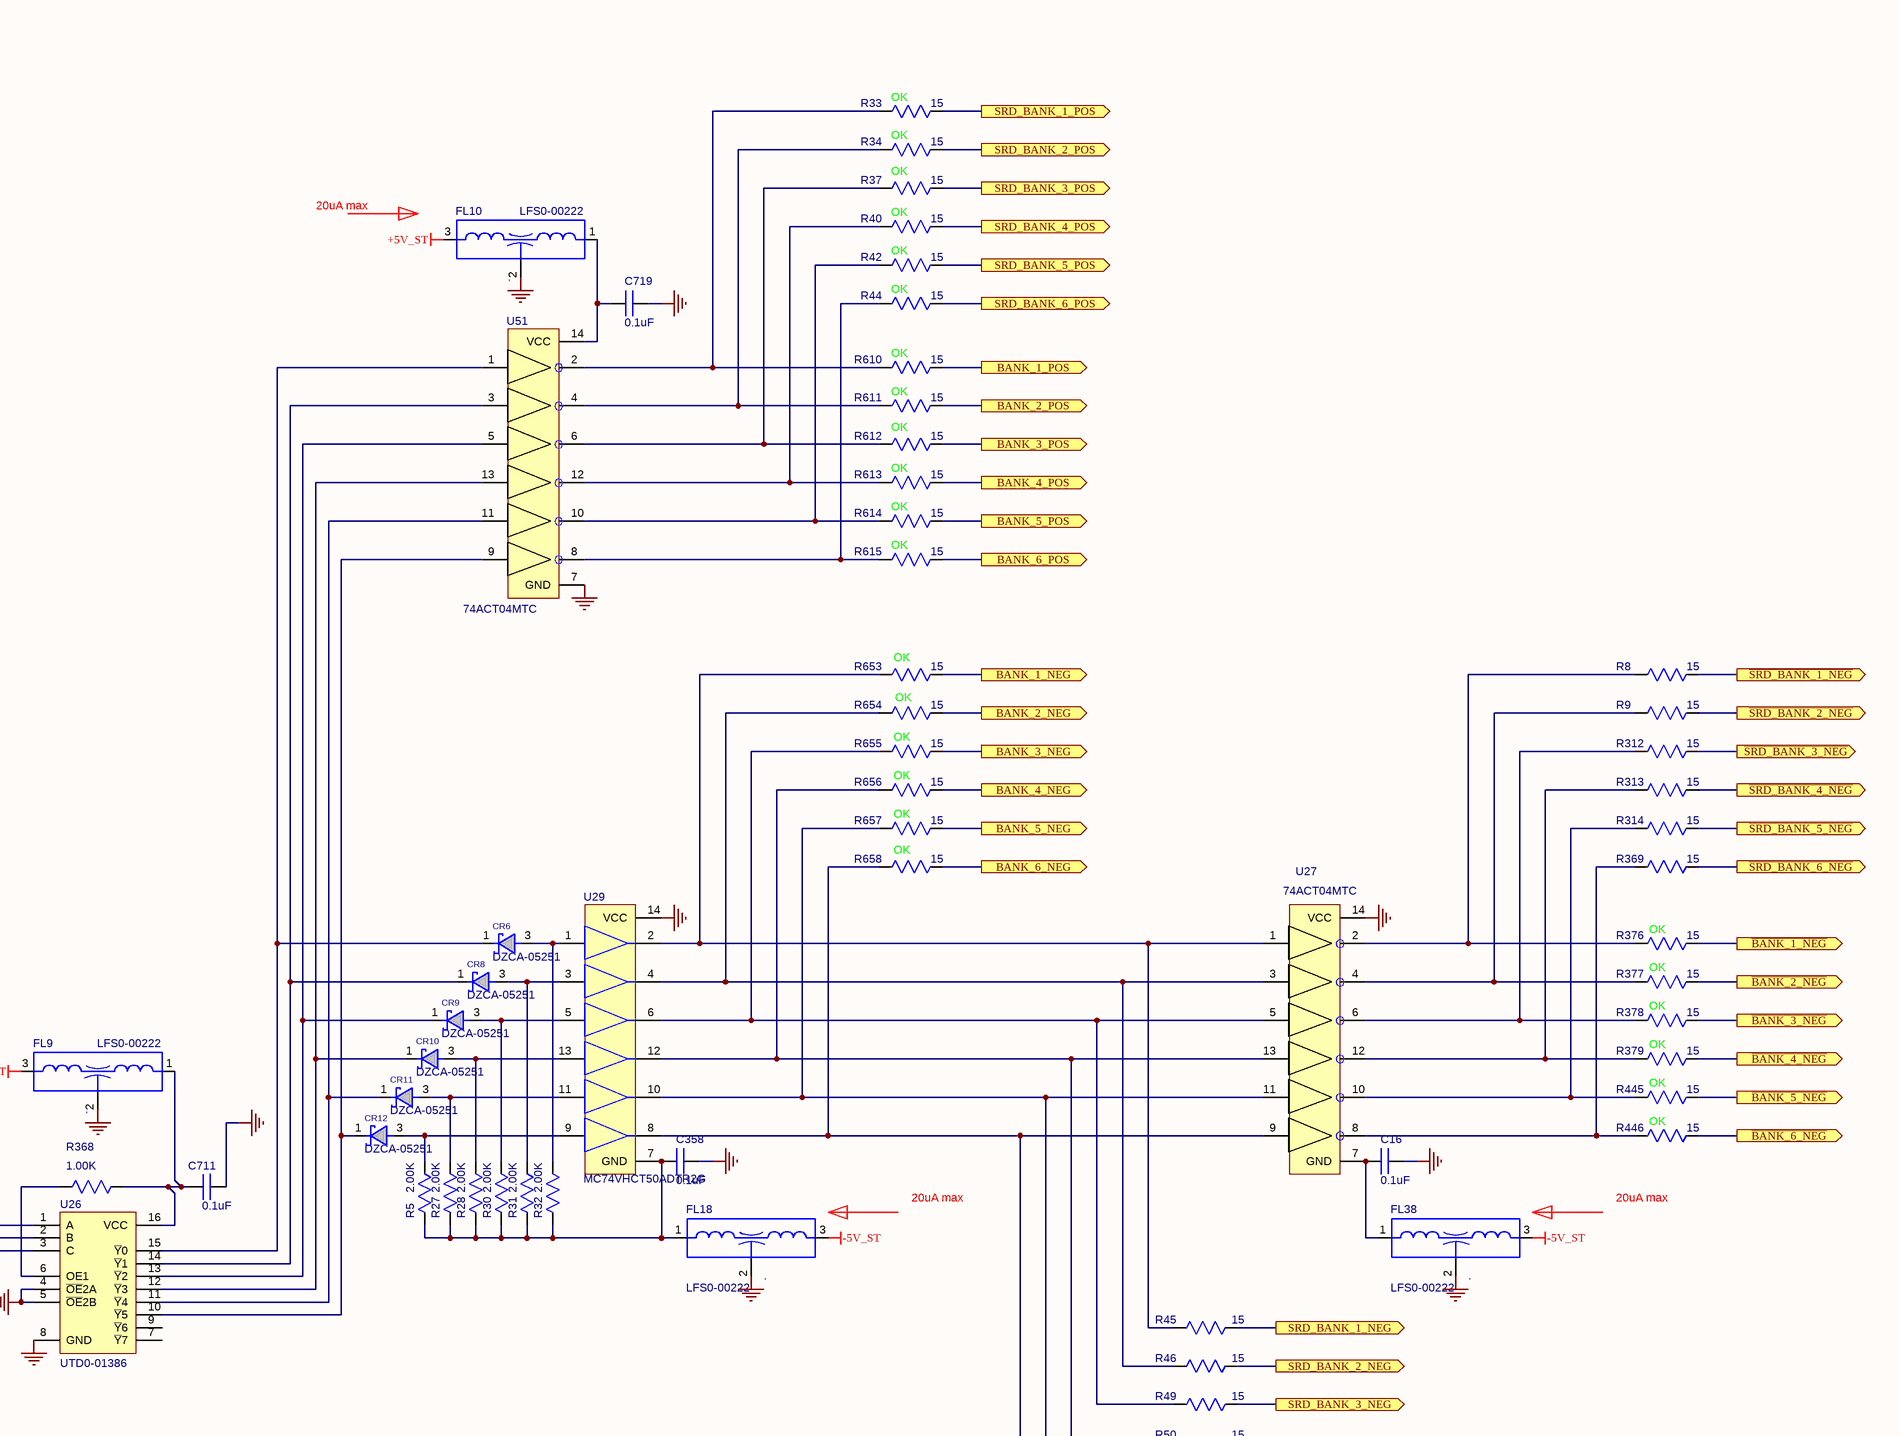
[diagram p62: STALO_3.SchDoc, top right]
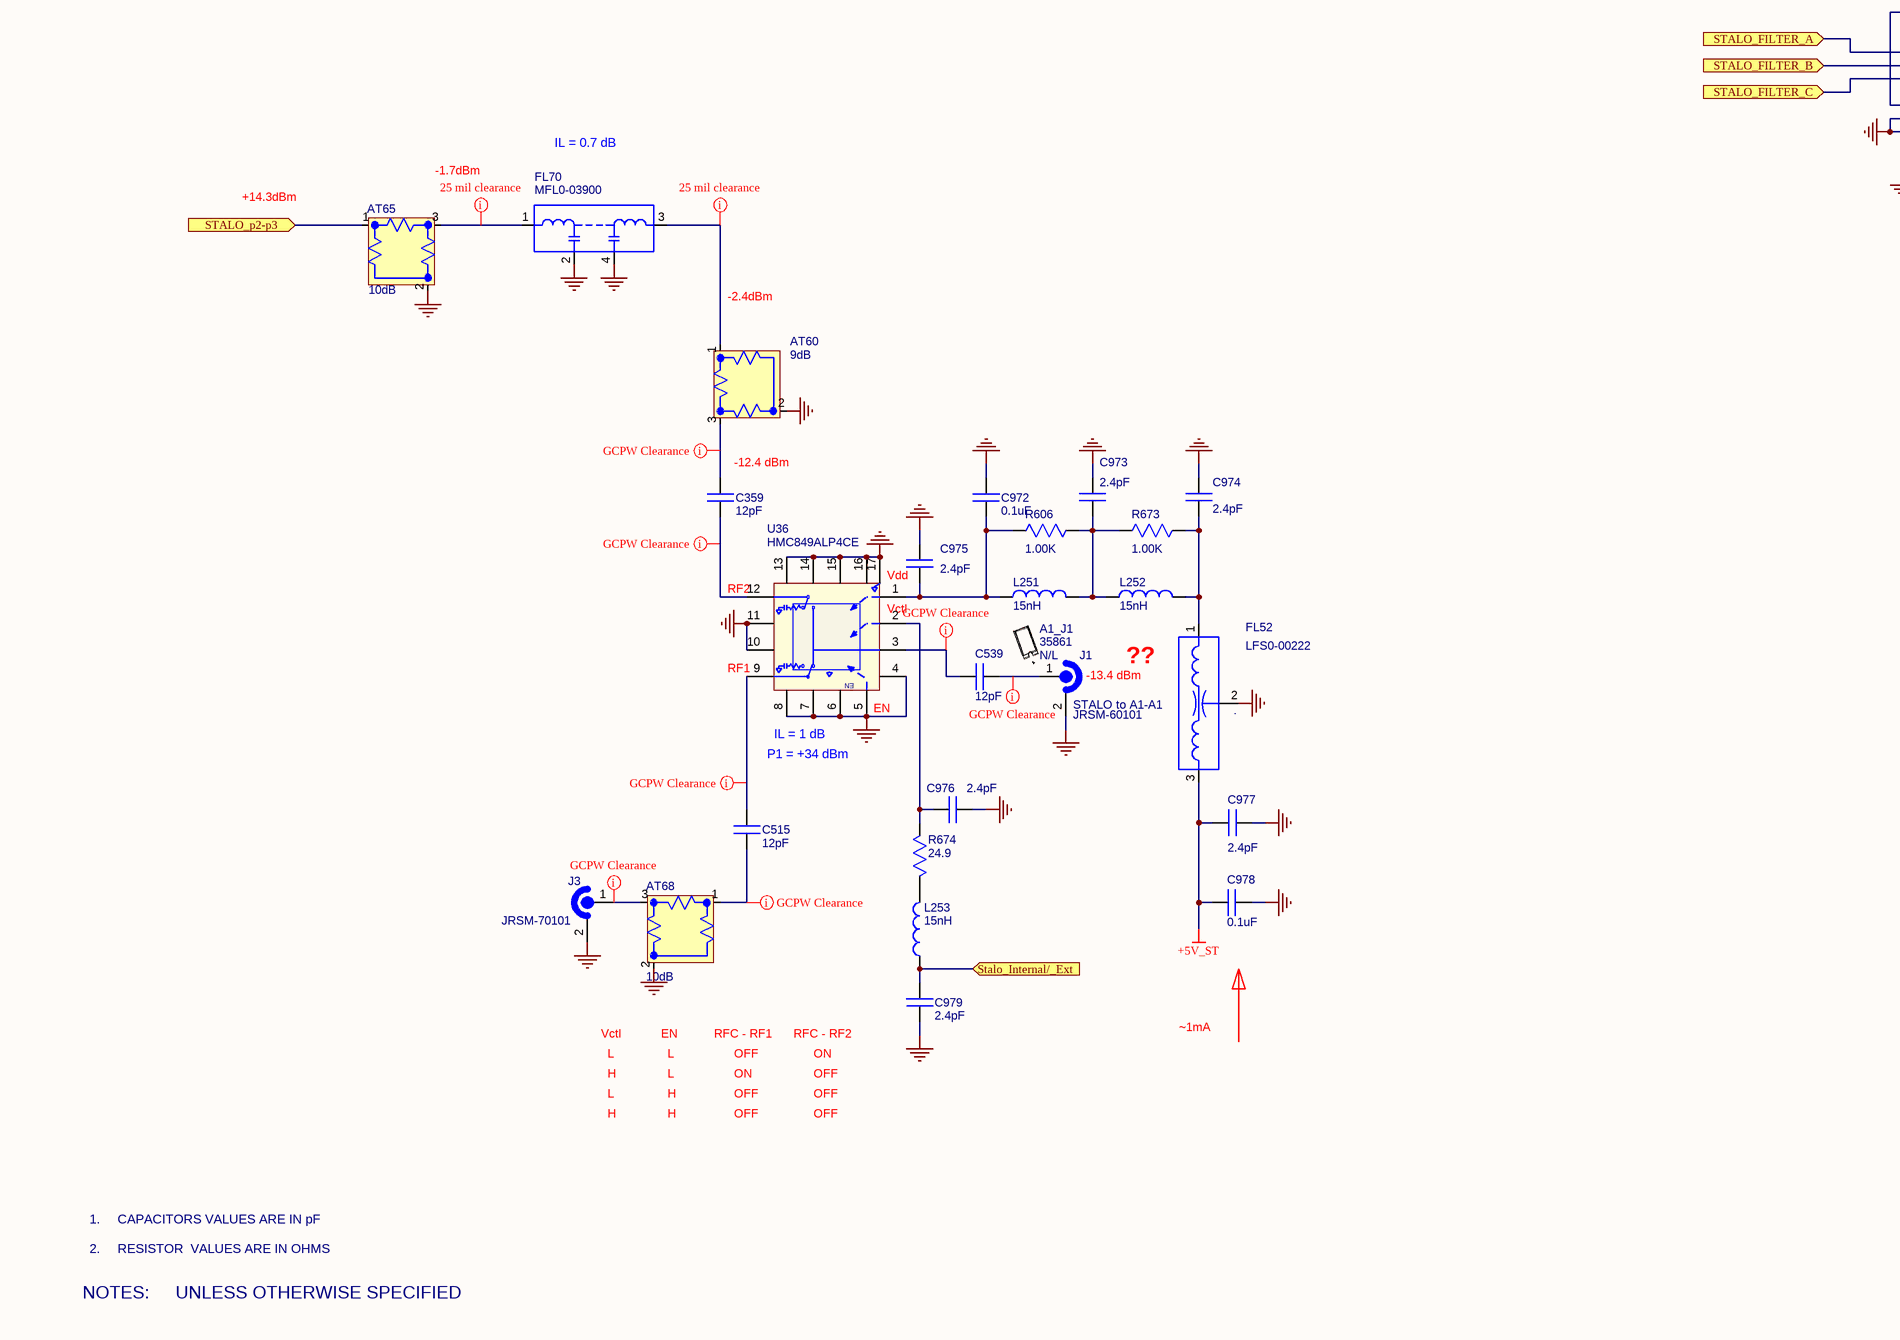
[diagram p63: STALO_3.SchDoc, bottom left]
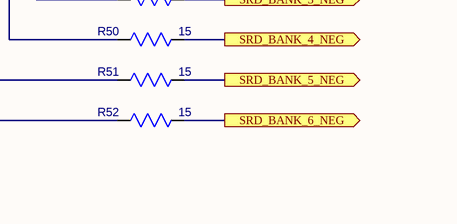
[diagram p64: STALO_3.SchDoc, bottom right]

### Parts
A1_J1  NoLoad: N/L  [35861]  (hidden comment: 35861)  (mechanical)
AT60  value 9dB  [ATTN-IMS-0805]  (hidden comment: PAD;CHIP;9dB;+/-.3dB;.08 x .05;50 OHM;FACE DOWN)
AT65  value 10dB  [ATTN-IMS-0805]  (hidden comment: PAD;CHIP;10dB;+/-.3dB;.08 x .05;50 OHM;FACE DOWN)
AT68  value 10dB  [ATTN-IMS-0805]  (hidden comment: PAD;CHIP;10dB;+/-.3dB;.08 x .05;50 OHM;FACE DOWN)
C16  value 0.1uF  [CAP-0402-N]  (hidden comment: .1 UF,10%;X7R;16V,CHIP;0402)
C358  value 0.1uF  [CAP-0402-N]  (hidden comment: .1 UF,10%;X7R;16V,CHIP;0402)
C359  value 12pF  [CAP-0402-N]  (hidden comment: 12 PF;5%;COG;>50V;CHIP;0402)
C515  value 12pF  [CAP-0402-N]  (hidden comment: 12 PF;5%;COG;>50V;CHIP;0402)
C539  value 12pF  [CAP-0402-N]  (hidden comment: 12 PF;5%;COG;>50V;CHIP;0402)
C711  value 0.1uF  [CAP-0402-N]  (hidden comment: .1 UF,10%;X7R;16V,CHIP;0402)
C719  value 0.1uF  [CAP-0402-N]  (hidden comment: .1 UF,10%;X7R;16V,CHIP;0402)
C972  value 0.1uF  [CAP-0402-N]  (hidden comment: .1 UF,10%;X7R;16V,CHIP;0402)
C973  value 2.4pF  [CAP-0402-RF]  (hidden comment: 2.4 PF;200V;.05PF;HIGH Q;SMT;CERAMIC;0402)
C974  value 2.4pF  [CAP-0402-RF]  (hidden comment: 2.4 PF;200V;.05PF;HIGH Q;SMT;CERAMIC;0402)
C975  value 2.4pF  [CAP-0402-RF]  (hidden comment: 2.4 PF;200V;.05PF;HIGH Q;SMT;CERAMIC;0402)
C976  value 2.4pF  [CAP-0402-RF]  (hidden comment: 2.4 PF;200V;.05PF;HIGH Q;SMT;CERAMIC;0402)
C977  value 2.4pF  [CAP-0402-RF]  (hidden comment: 2.4 PF;200V;.05PF;HIGH Q;SMT;CERAMIC;0402)
C978  value 0.1uF  [CAP-0402-N]  (hidden comment: .1 UF,10%;X7R;16V,CHIP;0402)
C979  value 2.4pF  [CAP-0402-RF]  (hidden comment: 2.4 PF;200V;.05PF;HIGH Q;SMT;CERAMIC;0402)
CR6  5.1V;5%;.15W;Z=20;0603  [DO-0603-SOD-523F]  (value not drawn)
CR8  5.1V;5%;.15W;Z=20;0603  [DO-0603-SOD-523F]  (value not drawn)
CR9  5.1V;5%;.15W;Z=20;0603  [DO-0603-SOD-523F]  (value not drawn)
CR10  5.1V;5%;.15W;Z=20;0603  [DO-0603-SOD-523F]  (value not drawn)
CR11  5.1V;5%;.15W;Z=20;0603  [DO-0603-SOD-523F]  (value not drawn)
CR12  5.1V;5%;.15W;Z=20;0603  [DO-0603-SOD-523F]  (value not drawn)
FL9  Filter EMI 2200PF,1206  [FIL-NFE31P-1206-4P]  (value not drawn)
FL10  Filter EMI 2200PF,1206  [FIL-NFE31P-1206-4P]  (value not drawn)
FL18  Filter EMI 2200PF,1206  [FIL-NFE31P-1206-4P]  (value not drawn)
FL38  Filter EMI 2200PF,1206  [FIL-NFE31P-1206-4P]  (value not drawn)
FL52  Filter EMI 2200PF,1206  [FIL-NFE31P-1206-4P]  (value not drawn)
FL70  FILTER;LOW PASS;3900MHz;7SEC;FV1206  [FV1206]  (value not drawn)
FT19  STALO_3  NoLoad: N/L  [FromToNode_ML2]  (net tie, no BOM)
J1  STALO to A1-A1  [JRSM-60101]
J3  .  [JRSM-70101]  (value not drawn)
L251  value 15nH  [IND-0402HP]  (hidden comment: INDUCTOR;15NH;2%;3.9GHZ SRF;85Q @1.7GHZ;.078 DCR;1.1A;0402)
L252  value 15nH  [IND-0402HP]  (hidden comment: INDUCTOR;15NH;2%;3.9GHZ SRF;85Q @1.7GHZ;.078 DCR;1.1A;0402)
L253  value 15nH  [IND-0402HP]  (hidden comment: INDUCTOR;15NH;2%;3.9GHZ SRF;85Q @1.7GHZ;.078 DCR;1.1A;0402)
MTG192  NoLoad: N/L  [MHP200X92]  (no BOM)
MTG193  NoLoad: N/L  [MHP200X92]  (no BOM)
MTG194  NoLoad: N/L  [MHP200X92]  (no BOM)
MTG195  NoLoad: N/L  [MHP200X92]  (no BOM)
MTG198  NoLoad: N/L  [MHP200X92]  (no BOM)
MTG199  NoLoad: N/L  [MHP200X92]  (no BOM)
R5  value 2.00K  [RES-0402-N]  (hidden comment: 2.00K OHMS;.06W;1%;200PPM;FILM;CHIP;0402)
R8  value 15  [RES-0402-N]  (hidden comment: 15 OHMS;.06W;1%;200PPM;FILM;CHIP;0402)
R9  value 15  [RES-0402-N]  (hidden comment: 15 OHMS;.06W;1%;200PPM;FILM;CHIP;0402)
R27  value 2.00K  [RES-0402-N]  (hidden comment: 2.00K OHMS;.06W;1%;200PPM;FILM;CHIP;0402)
R28  value 2.00K  [RES-0402-N]  (hidden comment: 2.00K OHMS;.06W;1%;200PPM;FILM;CHIP;0402)
R30  value 2.00K  [RES-0402-N]  (hidden comment: 2.00K OHMS;.06W;1%;200PPM;FILM;CHIP;0402)
R31  value 2.00K  [RES-0402-N]  (hidden comment: 2.00K OHMS;.06W;1%;200PPM;FILM;CHIP;0402)
R32  value 2.00K  [RES-0402-N]  (hidden comment: 2.00K OHMS;.06W;1%;200PPM;FILM;CHIP;0402)
R33  value 15  [RES-0402-N]  (hidden comment: 15 OHMS;.06W;1%;200PPM;FILM;CHIP;0402)
R34  value 15  [RES-0402-N]  (hidden comment: 15 OHMS;.06W;1%;200PPM;FILM;CHIP;0402)
R37  value 15  [RES-0402-N]  (hidden comment: 15 OHMS;.06W;1%;200PPM;FILM;CHIP;0402)
R40  value 15  [RES-0402-N]  (hidden comment: 15 OHMS;.06W;1%;200PPM;FILM;CHIP;0402)
R42  value 15  [RES-0402-N]  (hidden comment: 15 OHMS;.06W;1%;200PPM;FILM;CHIP;0402)
R44  value 15  [RES-0402-N]  (hidden comment: 15 OHMS;.06W;1%;200PPM;FILM;CHIP;0402)
R45  value 15  [RES-0402-N]  (hidden comment: 15 OHMS;.06W;1%;200PPM;FILM;CHIP;0402)
R46  value 15  [RES-0402-N]  (hidden comment: 15 OHMS;.06W;1%;200PPM;FILM;CHIP;0402)
R49  value 15  [RES-0402-N]  (hidden comment: 15 OHMS;.06W;1%;200PPM;FILM;CHIP;0402)
R50  value 15  [RES-0402-N]  (hidden comment: 15 OHMS;.06W;1%;200PPM;FILM;CHIP;0402)
R51  value 15  [RES-0402-N]  (hidden comment: 15 OHMS;.06W;1%;200PPM;FILM;CHIP;0402)
R52  value 15  [RES-0402-N]  (hidden comment: 15 OHMS;.06W;1%;200PPM;FILM;CHIP;0402)
R312  value 15  [RES-0402-N]  (hidden comment: 15 OHMS;.06W;1%;200PPM;FILM;CHIP;0402)
R313  value 15  [RES-0402-N]  (hidden comment: 15 OHMS;.06W;1%;200PPM;FILM;CHIP;0402)
R314  value 15  [RES-0402-N]  (hidden comment: 15 OHMS;.06W;1%;200PPM;FILM;CHIP;0402)
R368  value 1.00K  [RES-0402-N]  (hidden comment: 1.0K OHMS;.06W;1%;200PPM;FILM;CHIP;0402)
R369  value 15  [RES-0402-N]  (hidden comment: 15 OHMS;.06W;1%;200PPM;FILM;CHIP;0402)
R376  value 15  [RES-0402-N]  (hidden comment: 15 OHMS;.06W;1%;200PPM;FILM;CHIP;0402)
R377  value 15  [RES-0402-N]  (hidden comment: 15 OHMS;.06W;1%;200PPM;FILM;CHIP;0402)
R378  value 15  [RES-0402-N]  (hidden comment: 15 OHMS;.06W;1%;200PPM;FILM;CHIP;0402)
R379  value 15  [RES-0402-N]  (hidden comment: 15 OHMS;.06W;1%;200PPM;FILM;CHIP;0402)
R445  value 15  [RES-0402-N]  (hidden comment: 15 OHMS;.06W;1%;200PPM;FILM;CHIP;0402)
R446  value 15  [RES-0402-N]  (hidden comment: 15 OHMS;.06W;1%;200PPM;FILM;CHIP;0402)
R606  value 1.00K  [RES-0402-N]  (hidden comment: 1.0K OHMS;.06W;1%;200PPM;FILM;CHIP;0402)
R610  value 15  [RES-0402-N]  (hidden comment: 15 OHMS;.06W;1%;200PPM;FILM;CHIP;0402)
R611  value 15  [RES-0402-N]  (hidden comment: 15 OHMS;.06W;1%;200PPM;FILM;CHIP;0402)
R612  value 15  [RES-0402-N]  (hidden comment: 15 OHMS;.06W;1%;200PPM;FILM;CHIP;0402)
R613  value 15  [RES-0402-N]  (hidden comment: 15 OHMS;.06W;1%;200PPM;FILM;CHIP;0402)
R614  value 15  [RES-0402-N]  (hidden comment: 15 OHMS;.06W;1%;200PPM;FILM;CHIP;0402)
R615  value 15  [RES-0402-N]  (hidden comment: 15 OHMS;.06W;1%;200PPM;FILM;CHIP;0402)
R653  value 15  [RES-0402-N]  (hidden comment: 15 OHMS;.06W;1%;200PPM;FILM;CHIP;0402)
R654  value 15  [RES-0402-N]  (hidden comment: 15 OHMS;.06W;1%;200PPM;FILM;CHIP;0402)
R655  value 15  [RES-0402-N]  (hidden comment: 15 OHMS;.06W;1%;200PPM;FILM;CHIP;0402)
R656  value 15  [RES-0402-N]  (hidden comment: 15 OHMS;.06W;1%;200PPM;FILM;CHIP;0402)
R657  value 15  [RES-0402-N]  (hidden comment: 15 OHMS;.06W;1%;200PPM;FILM;CHIP;0402)
R658  value 15  [RES-0402-N]  (hidden comment: 15 OHMS;.06W;1%;200PPM;FILM;CHIP;0402)
R673  value 1.00K  [RES-0402-N]  (hidden comment: 1.0K OHMS;.06W;1%;200PPM;FILM;CHIP;0402)
R674  value 24.9  [RES-0402-N]  (hidden comment: 24.9 OHMS;.06W;1%;200PPM;FILM;CHIP;0402)
U26  UTD0-01386  [SOIC16_MS-012]
U27  M_PN: 74ACT04MTC  [TSOP65P640X120-14L]  (hidden comment: 74ACT04MTC HEX INVERTER;SMT;TSSOP-14)
U29  M_PN: MC74VHCT50ADTR2G  [TSOP65P640X120-14L]  (hidden comment: MC74VHCT50A;HEX BUFFERS;3.5NS;TTL INPUTS;TSSOP-14)
U36  M_PN: HMC849ALP4CE  [QFN-16_HITTITE_LP4CE]  (hidden comment: SWITCH;SPDT;DC-6GHz;50DB ISO;33DBM;3-5V CTRL;QFN-16)
U51  M_PN: 74ACT04MTC  [TSOP65P640X120-14L]  (hidden comment: 74ACT04MTC HEX INVERTER;SMT;TSSOP-14)

### Ports
BANK_1_NEG, BANK_1_POS, BANK_2_NEG, BANK_2_POS, BANK_3_NEG, BANK_3_POS, BANK_4_NEG, BANK_4_POS, BANK_5_NEG, BANK_5_POS, BANK_6_NEG, BANK_6_POS, SRD_BANK_1_NEG, SRD_BANK_1_POS, SRD_BANK_2_NEG, SRD_BANK_2_POS, SRD_BANK_3_NEG, SRD_BANK_3_POS, SRD_BANK_4_NEG, SRD_BANK_4_POS, SRD_BANK_5_NEG, SRD_BANK_5_POS, SRD_BANK_6_NEG, SRD_BANK_6_POS, STALO_FILTER_A, STALO_FILTER_B, STALO_FILTER_C, Stalo_Internal/_Ext, STALO_p2-p3, ~{BANK_1_NEG}, ~{BANK_2_NEG}, ~{BANK_3_NEG}, ~{BANK_4_NEG}, ~{BANK_5_NEG}, ~{BANK_6_NEG}, ~{SRD_BANK_1_NEG}, ~{SRD_BANK_2_NEG}, ~{SRD_BANK_3_NEG}, ~{SRD_BANK_4_NEG}, ~{SRD_BANK_5_NEG}, ~{SRD_BANK_6_NEG}

### Nets
+5V_ST: C977.2 C978.1 FL9.3(OUT) FL10.3(OUT) FL52.3(OUT) FT19.1
-5V_ST: FL18.3(OUT) FL38.3(OUT)
GND: AT60.2(GND) AT65.2(GND) AT68.2(GND) C16.2 C358.2 C711.2 C719.2 C972.2 C973.1 C974.1 C975.1 C976.2 C977.1 C978.2 C979.1 FL9.2(GND) FL10.2(GND) FL18.2(GND) FL38.2(GND) FL52.2(GND) FL70.2(OUT) FL70.4(GND) J1.2(GND) J3.2(GND) MTG192.MH MTG193.MH MTG194.MH MTG195.MH MTG198.MH MTG199.MH U26.4(~{OE}2A) U26.5(~{OE}2B) U26.8(GND) U27.14(VCC) U29.14(VCC) U36.4(NC) U36.5(EN) U36.6(NC) U36.7(NC) U36.8(NC) U36.10(GND) U36.11(GND) U36.13(NC) U36.14(NC) U36.15(NC) U36.16(NC) U36.17(GND) U51.7(GND)
~{BANK_1_NEG}: R376.2 ; port ~{BANK_1_NEG}
~{BANK_2_NEG}: R377.2 ; port ~{BANK_2_NEG}
~{BANK_3_NEG}: R378.2 ; port ~{BANK_3_NEG}
~{BANK_4_NEG}: R379.2 ; port ~{BANK_4_NEG}
~{BANK_5_NEG}: R445.2 ; port ~{BANK_5_NEG}
~{BANK_6_NEG}: R446.2 ; port ~{BANK_6_NEG}
BANK_1_NEG: R653.2 ; port BANK_1_NEG
BANK_1_POS: R610.2 ; port BANK_1_POS
BANK_2_NEG: R654.2 ; port BANK_2_NEG
BANK_2_POS: R611.2 ; port BANK_2_POS
BANK_3_NEG: R655.2 ; port BANK_3_NEG
BANK_3_POS: R612.2 ; port BANK_3_POS
BANK_4_NEG: R656.2 ; port BANK_4_NEG
BANK_4_POS: R613.2 ; port BANK_4_POS
BANK_5_NEG: R657.2 ; port BANK_5_NEG
BANK_5_POS: R614.2 ; port BANK_5_POS
BANK_6_NEG: R658.2 ; port BANK_6_NEG
BANK_6_POS: R615.2 ; port BANK_6_POS
~{SRD_BANK_1_NEG}: R8.2 ; port ~{SRD_BANK_1_NEG}
~{SRD_BANK_2_NEG}: R9.2 ; port ~{SRD_BANK_2_NEG}
~{SRD_BANK_3_NEG}: R312.2 ; port ~{SRD_BANK_3_NEG}
~{SRD_BANK_4_NEG}: R313.2 ; port ~{SRD_BANK_4_NEG}
~{SRD_BANK_5_NEG}: R314.2 ; port ~{SRD_BANK_5_NEG}
~{SRD_BANK_6_NEG}: R369.2 ; port ~{SRD_BANK_6_NEG}
SRD_BANK_1_NEG: R45.2 ; port SRD_BANK_1_NEG
SRD_BANK_1_POS: R33.2 ; port SRD_BANK_1_POS
SRD_BANK_2_NEG: R46.2 ; port SRD_BANK_2_NEG
SRD_BANK_2_POS: R34.2 ; port SRD_BANK_2_POS
SRD_BANK_3_NEG: R49.2 ; port SRD_BANK_3_NEG
SRD_BANK_3_POS: R37.2 ; port SRD_BANK_3_POS
SRD_BANK_4_NEG: R50.2 ; port SRD_BANK_4_NEG
SRD_BANK_4_POS: R40.2 ; port SRD_BANK_4_POS
SRD_BANK_5_NEG: R51.2 ; port SRD_BANK_5_NEG
SRD_BANK_5_POS: R42.2 ; port SRD_BANK_5_POS
SRD_BANK_6_NEG: R52.2 ; port SRD_BANK_6_NEG
SRD_BANK_6_POS: R44.2 ; port SRD_BANK_6_POS
NetAT60_1: AT60.1(IN/OUT) FL70.3(GND)
NetAT60_3: AT60.3(IN/OUT) C359.2
NetAT65_1: AT65.1(IN/OUT) ; port STALO_p2-p3
NetAT65_3: AT65.3(IN/OUT) FL70.1(IN)
NetAT68_1: AT68.1(IN/OUT) C515.1
NetAT68_3: AT68.3(IN/OUT) J3.1(CNTR)
NetC16_1: C16.1 FL38.1(IN) U27.7(GND)
NetC358_1: C358.1 FL18.1(IN) R5.1 R27.1 R28.1 R30.1 R31.1 R32.1 U29.7(GND)
NetC359_1: C359.1 U36.12(RF2)
NetC515_2: C515.2 U36.9(RF1)
NetC539_1: C539.1 J1.1(CNTR)
NetC539_2: C539.2 U36.3(RFC)
NetC711_1: C711.1 FL9.1(IN) R368.2 U26.16(VCC)
NetC719_1: C719.1 FL10.1(IN) U51.14(VCC)
NetC972_1: C972.1 C975.2 L251.1 R606.1 U36.1(Vdd)
NetC973_2: C973.2 L251.2 L252.1 R606.2 R673.1
NetC974_2: C974.2 FL52.1(IN) L252.2 R673.2
NetC976_1: C976.1 R674.1 U36.2(Vctl)
NetC979_2: C979.2 L253.2 ; port Stalo_Internal/_Ext
NetCR6_1: CR6.1(K) U26.15(~{Y}0) U51.1
NetCR6_3: CR6.3(A) R32.2 U29.1
NetCR8_1: CR8.1(K) U26.14(~{Y}1) U51.3
NetCR8_3: CR8.3(A) R31.2 U29.3
NetCR9_1: CR9.1(K) U26.13(~{Y}2) U51.5
NetCR9_3: CR9.3(A) R30.2 U29.5
NetCR10_1: CR10.1(K) U26.12(~{Y}3) U51.13
NetCR10_3: CR10.3(A) R28.2 U29.13
NetCR11_1: CR11.1(K) U26.11(~{Y}4) U51.11
NetCR11_3: CR11.3(A) R27.2 U29.11
NetCR12_1: CR12.1(K) U26.10(~{Y}5) U51.9
NetCR12_3: CR12.3(A) R5.2 U29.9
NetL253_1: L253.1 R674.2
NetR8_1: R8.1 R376.1 U27.2
NetR9_1: R9.1 R377.1 U27.4
NetR33_1: R33.1 R610.1 U51.2
NetR34_1: R34.1 R611.1 U51.4
NetR37_1: R37.1 R612.1 U51.6
NetR40_1: R40.1 R613.1 U51.12
NetR42_1: R42.1 R614.1 U51.10
NetR44_1: R44.1 R615.1 U51.8
NetR45_1: R45.1 R653.1 U27.1 U29.2
NetR46_1: R46.1 R654.1 U27.3 U29.4
NetR49_1: R49.1 R655.1 U27.5 U29.6
NetR50_1: R50.1 R656.1 U27.13 U29.12
NetR51_1: R51.1 R657.1 U27.11 U29.10
NetR52_1: R52.1 R658.1 U27.9 U29.8
NetR312_1: R312.1 R378.1 U27.6
NetR313_1: R313.1 R379.1 U27.12
NetR314_1: R314.1 R445.1 U27.10
NetR368_1: R368.1 U26.6(OE1)
NetR369_1: R369.1 R446.1 U27.8
NetR545_2: U26.3(C) ; port STALO_FILTER_C
NetR546_2: U26.2(B) ; port STALO_FILTER_B
NetR547_2: U26.1(A) ; port STALO_FILTER_A

Not connected (* = marked no-connect by the designer): U26 7(~{Y}7) 9(~{Y}6)

### Layout directives
net class GCPW Clearance: NetAT60_3, NetAT68_1, NetAT68_3, NetC359_1, NetC515_2, NetC539_1, NetC539_2
net class 25 mil clearance: NetAT60_1, NetAT65_3

### Notes on the sheet
- AND DESIGN RIGHTS BELONGING TO GIGA-TRONICS
- THIS DOCUMENT CONTAINS PROPRIETARY INFORMATION
- EXCEPT CALIBRATION, OPERATION, AND MAINTENANCE
- AND MAY NOT BE REPRODUCED FOR ANY REASON
- STALO FILTER SELECT 3 TO 6 DECODER
- (near R33) OK
- WITHOUT WRITTEN AUTHORIZATION.
- (near R34) OK
- OK
- 20uA max
- (near R40) OK
- (near R42) OK
- (near R44) OK
- (near R610) OK
- (near R611) OK
- (near R613) OK
- (near R614) OK
- (near R615) OK
- (near R653) OK
- (near R654) OK
- (near R655) OK
- (near R656) OK
- (near R657) OK
- (near R376) OK
- (near R377) OK
- (near R378) OK
- 4uA
- (near R379) OK
- (near R445) OK
- (near R446) OK
- IL = 0.7 dB
- +14.3dBm
- -1.7dBm
- -2.4dBm
- (near C359) -12.4 dBm
- (near U36) RF2
- (near U36) Vdd
- (near U36) Vctl
- (near U36) RF1
- (near J1) -13.4 dBm
- ??
- P1 = +34 dBm
- (near U36) IL = 1 dB
- (near U36) EN
- Vctl
- EN
- RFC - RF1
- RFC - RF2
- ~1mA
- L
- H
- OFF
- ON
- 1.     CAPACITORS VALUES ARE IN pF
- NOTES:
- 2.     RESISTOR  VALUES ARE IN OHMS
- UNLESS OTHERWISE SPECIFIED
- Title
- Sheet Title
- PRINTED DOCUMENT IS CONSIDERED UNCONTROLLED. VERIFY REVISION IN PLM SYSTEM.
- THIS DOCUMENT CONTAINS PROPRIETARY INFORMATION. DESIGN RIGHTS BELONG TO GIGA-TRONICS AND MAY NOT BE REPRODUCED WITHOUT WRITTEN AUTHORIZATION FOR ANY REASON EXCEPT CALIBRATION, OPERATION AND MAINTENANCE.
- Size
- CAGE CODE
- Filename
- D
- Document Number
- 58900
- Date
- Sheet
- Rev
- of
- (in symbol LFS0-00222) ,

### Library data of the parts
A1_J1 = 35861: SHIELD,HYDRA,A1-J1; MFGR: Any; Approved: MH; level: 1; ModifyDate: 08/28/15; M_PN: Any; G_PN: 35861; Value: 35861; item_number: 35861
AT60 = MPFC-A1009: NoLoad: .; Approved: CL; M_PN: IMS1141-09DB; MFGR: IMS RESISTORS; level: 1; line_number: 40; ModifyDate: 3/.8/13; G_PN: MPFC-A1009; item_number: MPFC-A1009
AT65 AT68 = MPFC-A1010: as AT56 on sheet STALO_1; ModifyDate: 4/23/13; G_PN: MPFC-A1010; item_number: MPFC-A1010
C16 C358 C711 C719 = CK40-04100: Approved: CL; NoLoad: .; MFGR: VENKEL; M_PN: C0402X7R160-104KNP; level: 1; line_number: 95; ModifyDate: 3/29/13; G_PN: CK40-04100; item_number: CK40-04100
  C16 C358: ClassName: FSb
  C719: ClassName: FSa
C359 C515 C539 = CK40-00120: as C3 on sheet STALO_1; ModifyDate: 10/06/12; M_PN: ANY; G_PN: CK40-00120; item_number: CK40-00120
C972 C978 = CK40-04100: Approved: CL; NoLoad: .; M_PN: C0402X7R160-104KNP; MFGR: VENKEL; level: 1; line_number: 95; ModifyDate: 3/29/13; G_PN: CK40-04100; item_number: CK40-04100
C973-C975 C977 = CK41-00024: NoLoad: .; MFGR: ATC; M_PN: 600L2R4AT200; Approved: CL; level: 1; line_number: 60; G_PN: CK41-00024; ModifyDate: 02/09/13; item_number: CK41-00024
C976 C979 = CK41-00024: as C1 on sheet STALO_1; ModifyDate: 02/09/13; G_PN: CK41-00024; item_number: CK41-00024
CR6 CR8-CR12 = DZCA-05251: Value: CZRU52C5V1; NoLoad: .; Approved: CL; level: 1; line_number: 333; M_PN: 5.1V;5%;.15W;Z=20;0603; ModifyDate: 01/08/14; G_PN: DZCA-05251; item_number: DZCA-05251
FL9 FL10 FL18 FL38 FL52 = LFS0-00222: as FL1 on sheet STALO_1; G_PN: LFS0-00222; ModifyDate: 02/22/12; Value: 2200pF; item_number: LFS0-00222
  FL10: ClassName: FSa
  FL18 FL38: ClassName: FSb
FL70 = MFL0-03900: NoLoad: .; MFGR: Mini-Circuits; Approved: NM; level: 1; line_number: 440; ModifyDate: 11/17/12; M_PN: LFCN-3800; G_PN: MFL0-03900; item_number: MFL0-03900
FT19 = FromToNode: level: 1; Approved: *; G_PN: *; MFGR: *; Value: *
J1 = JRSM-60101: SMPM SM MALE,STRAIGHT SMT, R/A COPLANAR, 4 PIN THRU-HOLE; Value: B012-P95-02; MFGR: GILBERT; Approved: CL; NoLoad: .; level: 1; line_number: 483; M_PN: B012-P95-02; ModifyDate: 1/6/14; G_PN: JRSM-60101; item_number: JRSM-60101
J3 = JRSM-70101: SMPM FD MALE,STRAIGHT SMT, R/A COPLANAR, 4 PIN THRU-HOLE; Value: B012-P93-02; MFGR: GILBERT; Approved: CL; level: 1; line_number: 480; M_PN: B012-P93-02; NoLoad: .; ModifyDate: 10/15/14; G_PN: JRSM-70101; item_number: JRSM-70101
L251 L252 = LSA6-03150: M_PN: 0402HP-15NXGLU; MFGR: COILCRAFT; NoLoad: .; Approved: CL; level: 1; line_number: 515; G_PN: LSA6-03150; ModifyDate: 3/8/13; item_number: LSA6-03150
L253 = LSA6-03150: as L91 on sheet STALO_1; ModifyDate: 3/8/13; G_PN: LSA6-03150; item_number: LSA6-03150
MTG192-MTG195 MTG198 MTG199 = MHP200X92: level: 1; ModifyDate: 02/14/2008 14:07:19; Value: *
R5 R27 R28 R30-R32 = RK35-12000: Approved: CL; NoLoad: .; MFGR: ANY; level: 1; line_number: 660; G_PN: RK35-12000; ModifyDate: 02/22/12; M_PN: ANY; item_number: RK35-12000
R8 R9 R33 R34 R37 R40 R42 R44-R46 R49-R52 R312-R314 R369 R376-R379 R445 R446 R610-R615 R653-R658 = RK35-00150: Approved: CL; NoLoad: .; MFGR: ANY; level: 1; line_number: 915; G_PN: RK35-00150; ModifyDate: 02/22/13; M_PN: ANY; item_number: RK35-00150
  R8 R9 R45 R46 R49-R52 R312-R314 R369: ClassName: FSc
  R33 R34 R37 R40 R42 R44 R610-R615: ClassName: FSa
  R376-R379 R445 R446 R653-R658: ClassName: FSb
R368 = RK35-11000: Approved: CL; NoLoad: .; MFGR: ANY; level: 1; line_number: 1025; G_PN: RK35-11000; ModifyDate: 02/22/12; M_PN: ANY; item_number: RK35-11000
R606 R673 = RK35-11000: NoLoad: .; Approved: CL; MFGR: ANY; level: 1; line_number: 1025; G_PN: RK35-11000; ModifyDate: 02/22/12; M_PN: ANY; item_number: RK35-11000
R674 = RK35-00249: as R319 on sheet STALO_1; G_PN: RK35-00249; ModifyDate: 02/22/12; M_PN: ANY; item_number: RK35-00249
U26 = UTD0-01386: 3 TO 8 DECODER/DEMULTIPLEXER;74ACT138 LOGIC;SO-16; Approved: NM; MFGR: FAIRCHILD; M_PN: 74ACT138SC; NoLoad: .; level: 1; line_number: 1165; ModifyDate: 11/8/12; Value: *; G_PN: UTD0-01386; item_number: UTD0-01386
U27 U51 = UTD4-00046: MFGR: Fairchild; NoLoad: .; Approved: NM; level: 1; line_number: 1175; Value: *; ModifyDate: 10/27/12; G_PN: UTD4-00046; item_number: UTD4-00046
  U27: ClassName: FSb
  U51: ClassName: FSa
U29 = UTD0-00050: Value: MC74VHCT50ADTR2G; MFGR: ON SEMI; NoLoad: .; Approved: CL; level: 1; line_number: 1177; ModifyDate: 4/21/13; G_PN: UTD0-00050; ClassName: FSb; item_number: UTD0-00050
U36 = MRSS-12206: MFGR: HITTITE; Approved: CL; Value: HMC849ALP4CE; NoLoad: .; level: 1; line_number: 1347; ModifyDate: 8/5/14; G_PN: MRSS-12206; item_number: MRSS-12206